# Altium project mat'_v4.PrjPcb (part 1 of 2)
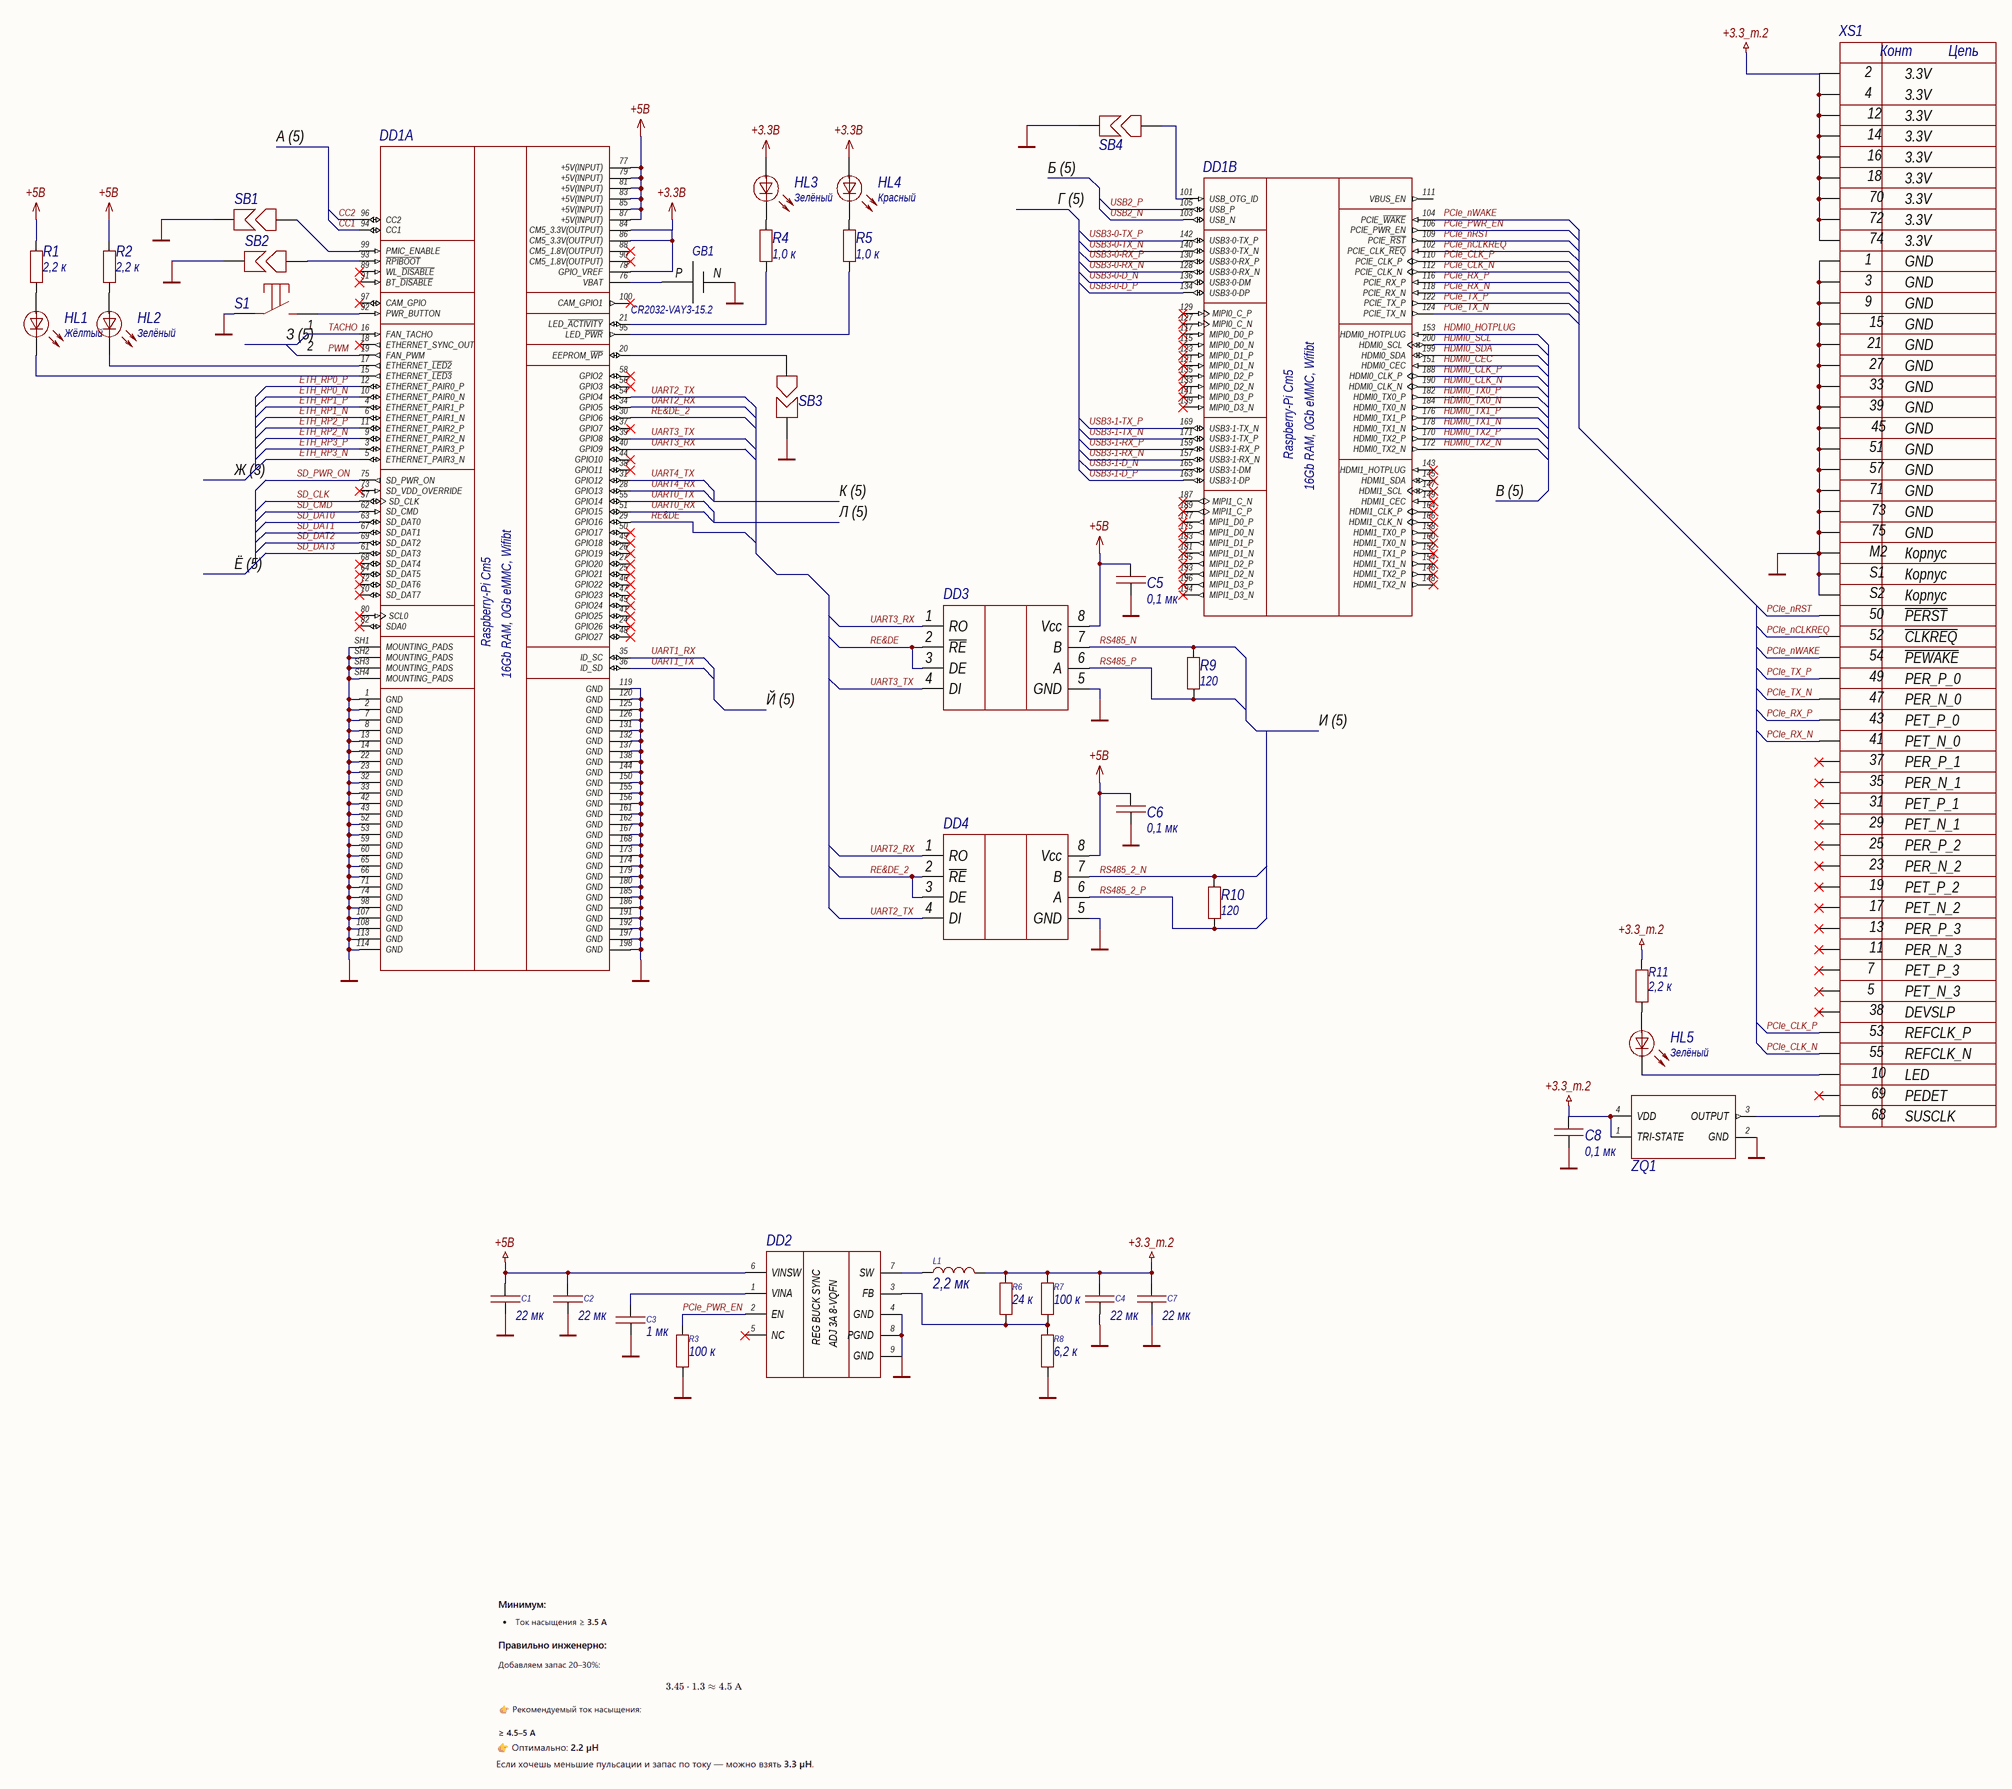
[diagram p0: cm5.SchDoc]
CheckedBy: Захаржевский С.; Decimal_Number_PCB: РТ2.11.03.03.26.08.81.15.002; Decimal_Number_Shematic: РТ2.11.03.03.26.08.81.15.003; DrawnBy: Карманов С.; Release_Date: 16.04.26; Title: Материнская плата аппарата NeoWelt v.2; Title1: Материнская плата; Title2: аппарата NeoWelt v.2; Version: 04
6 sheets, 224 parts. Net scope: global (net labels, ports and power ports of the same name join across sheets).
Board file: motherfucker_pcb.PcbDoc
Sheets:
  cm5.SchDoc
  DCDC_RPI.SchDoc
  1gb_switch.SchDoc
  dc-dc_eth+pump.SchDoc
  connectors.SchDoc
  DCDC_Jetson.SchDoc

## Sheet cm5.SchDoc: Материнская плата аппарата NeoWelt v.2
size 594 x 420 mm; Address1: Address1; Address2: Address2; Address3: Address3; Address4: Address4; DocumentNumber: 1; SheetNumber: 1; SheetTotal: 6; Перв_применение: РТ2.11.03.03.26.08.81.15.003 Э3

### Parts
(Parts that share a designator on the sheet are numbered #1, #2 ... from top to bottom, then left to right.)
C1#1  value 22 мк  [1210C]  (hidden comment: Capacitor)
C2#1  value 22 мк  [1210C]  (hidden comment: Capacitor)
C3#1  value 1 мк  [0603C]  (hidden comment: Capacitor)
C4#1  value 22 мк  [1210C]  (hidden comment: Capacitor)
C5#1  value 0,1 мк  [0603C]  (hidden comment: Capacitor)
C6#1  value 0,1 мк  [0603C]  (hidden comment: Capacitor)
C7#1  value 22 мк  [1210C]  (hidden comment: Capacitor)
C8#1  value 0,1 мк  [0603C]  (hidden comment: Capacitor)
DD1  CM5116000  [CM5116000]  (value not drawn)  (parts A,B of 2)
DD2  ST1S40IPUR  [VFQFPN8-4X4]  (value not drawn)
DD3  MAX485CSA  [SOIC-8]  (value not drawn)
DD4  MAX485CSA  [SOIC-8]  (value not drawn)
GB1  CR2032-VAY3-15.2  [CR2032-VAY3-15.2]
HL1  value Жёлтый  [0603D_yellow]  (hidden comment: LED 0603 YELLOW)
HL2  value Зелёный  [0603D_green]  (hidden comment: LED 0603 GREEN)
HL3  value Зелёный  [0603D_green]  (hidden comment: LED 0603 GREEN)
HL4  value Красный  [0603D_red]  (hidden comment: LED 0603 RED)
HL5  value Зелёный  [0603D_green]  (hidden comment: LED 0603 GREEN)
L1#1  value 2,2 мк  [IHLP-2020]  (hidden comment: IHLP2020BZER2R2M01)
R1  value 2,2 к  [0603R]  (hidden comment: Resistor)
R2#1  value 2,2 к  [0603R]  (hidden comment: Resistor)
R3#1  value 100 к  [0603R]  (hidden comment: Resistor)
R4#1  value 1,0 к  [0603R]  (hidden comment: Resistor)
R5#1  value 1,0 к  [0603R]  (hidden comment: Resistor)
R6#1  value 24 к  [0603R]  (hidden comment: Resistor)
R7#1  value 100 к  [0603R]  (hidden comment: Resistor)
R8#1  value 6,2 к  [0603R]  (hidden comment: Resistor)
R9#1  value 120  [1206R]  (hidden comment: Resistor)
R10#1  value 120  [1206R]  (hidden comment: Resistor)
R11#1  value 2,2 к  [0603R]  (hidden comment: Resistor)
S1  TSS-TD-19XA-XTR  [TSS-TD-19XA-XTR]  (value not drawn)
SB1  SB  [0603SB]  (value not drawn)  (net tie, no BOM)
SB2  SB  [0603SB]  (value not drawn)  (net tie, no BOM)
SB3  SB  [0603SB]  (value not drawn)  (net tie, no BOM)
SB4  SB  [0603SB]  (value not drawn)  (net tie, no BOM)
XS1  123A-30M00  [123A-30M00]  (value not drawn)
ZQ1  ASEK-32.768KHZ-LRT  [XTAL_ASEK-32.768KHZ-LRT]  (value not drawn)

### Nets
+3.3_m.2: C4#1.2 C7#1.2 C8#1.2 L1#1.2 R6#1.2 R7#1.2 R11#1.2 XS1.2(3.3V) XS1.4(3.3V) XS1.12(3.3V) XS1.14(3.3V) XS1.16(3.3V) XS1.18(3.3V) XS1.70(3.3V) XS1.72(3.3V) XS1.74(3.3V) ZQ1.1(TRI-STATE) ZQ1.4(VDD)
+3.3В: DD1.78(GPIO_VREF) DD1.84(CM5_3.3V(OUTPUT)) DD1.86(CM5_3.3V(OUTPUT)) HL3.1 HL4.1
+5В: C1#1.2 C2#1.2 C5#1.2 C6#1.2 DD1.77(+5V(INPUT)) DD1.79(+5V(INPUT)) DD1.81(+5V(INPUT)) DD1.83(+5V(INPUT)) DD1.85(+5V(INPUT)) DD1.87(+5V(INPUT)) DD2.6(VINSW) DD3.8(Vcc) DD4.8(Vcc) R1.2 R2#1.2
GND: C1#1.1 C2#1.1 C3#1.1 C4#1.1 C5#1.1 C6#1.1 C7#1.1 C8#1.1 DD1.1(GND) DD1.2(GND) DD1.7(GND) DD1.8(GND) DD1.13(GND) DD1.14(GND) DD1.22(GND) DD1.23(GND) DD1.32(GND) DD1.33(GND) DD1.42(GND) DD1.43(GND) DD1.52(GND) DD1.53(GND) DD1.59(GND) DD1.60(GND) DD1.65(GND) DD1.66(GND) DD1.71(GND) DD1.74(GND) DD1.98(GND) DD1.107(GND) DD1.108(GND) DD1.113(GND) DD1.114(GND) DD1.119(GND) DD1.120(GND) DD1.125(GND) DD1.126(GND) DD1.131(GND) DD1.132(GND) DD1.137(GND) DD1.138(GND) DD1.144(GND) DD1.150(GND) DD1.155(GND) DD1.156(GND) DD1.161(GND) DD1.162(GND) DD1.167(GND) DD1.168(GND) DD1.173(GND) DD1.174(GND) DD1.179(GND) DD1.180(GND) DD1.185(GND) DD1.186(GND) DD1.191(GND) DD1.192(GND) DD1.197(GND) DD1.198(GND) DD1.SH1(MOUNTING_PADS) DD1.SH2(MOUNTING_PADS) DD1.SH3(MOUNTING_PADS) DD1.SH4(MOUNTING_PADS) DD2.4(GND) DD2.8(PGND) DD2.9(GND) DD3.5(GND) DD4.5(GND) GB1.N R3#1.1 R8#1.1 S1.1 SB1.2 SB2.2 SB3.2 SB4.2 XS1.1(GND) XS1.3(GND) XS1.9(GND) XS1.15(GND) XS1.21(GND) XS1.27(GND) XS1.33(GND) XS1.39(GND) XS1.45(GND) XS1.51(GND) XS1.57(GND) XS1.71(GND) XS1.73(GND) XS1.75(GND) XS1.M2(Корпус) XS1.S1(Корпус) XS1.S2(Корпус) ZQ1.2(GND)
CC1: DD1.94(CC1)
CC2: DD1.96(CC2)
ETH_RP0_N: DD1.10(ETHERNET_PAIR0_N)
ETH_RP0_P: DD1.12(ETHERNET_PAIR0_P)
ETH_RP1_N: DD1.6(ETHERNET_PAIR1_N)
ETH_RP1_P: DD1.4(ETHERNET_PAIR1_P)
ETH_RP2_N: DD1.9(ETHERNET_PAIR2_N)
ETH_RP2_P: DD1.11(ETHERNET_PAIR2_P)
ETH_RP3_N: DD1.5(ETHERNET_PAIR3_N)
ETH_RP3_P: DD1.3(ETHERNET_PAIR3_P)
HDMI0_CEC: DD1.151(HDMI0_CEC)
HDMI0_CLK_N: DD1.190(HDMI0_CLK_N)
HDMI0_CLK_P: DD1.188(HDMI0_CLK_P)
HDMI0_HOTPLUG: DD1.153(HDMI0_HOTPLUG)
HDMI0_SCL: DD1.200(HDMI0_SCL)
HDMI0_SDA: DD1.199(HDMI0_SDA)
HDMI0_TX0_N: DD1.184(HDMI0_TX0_N)
HDMI0_TX0_P: DD1.182(HDMI0_TX0_P)
HDMI0_TX1_N: DD1.178(HDMI0_TX1_N)
HDMI0_TX1_P: DD1.176(HDMI0_TX1_P)
HDMI0_TX2_N: DD1.172(HDMI0_TX2_N)
HDMI0_TX2_P: DD1.170(HDMI0_TX2_P)
PCIe_CLK_N: DD1.112(PCIE_CLK_N) XS1.55(REFCLK_N)
PCIe_CLK_P: DD1.110(PCIE_CLK_P) XS1.53(REFCLK_P)
PCIe_nCLKREQ: DD1.102(PCIE_CLK_~{REQ}) XS1.52(~{CLKREQ})
PCIe_nRST: DD1.109(PCIE_~{RST}) XS1.50(~{PERST})
PCIe_nWAKE: DD1.104(PCIE_~{WAKE}) XS1.54(~{PEWAKE})
PCIe_PWR_EN: DD1.106(PCIE_PWR_EN) DD2.2(EN) R3#1.2
PCIe_RX_N: DD1.118(PCIE_RX_N) XS1.41(PET_N_0)
PCIe_RX_P: DD1.116(PCIE_RX_P) XS1.43(PET_P_0)
PCIe_TX_N: DD1.124(PCIE_TX_N) XS1.47(PER_N_0)
PCIe_TX_P: DD1.122(PCIE_TX_P) XS1.49(PER_P_0)
PWM: DD1.19(FAN_PWM)
RE&DE: DD1.29(GPIO16) DD3.2(~{RE}) DD3.3(DE)
RE&DE_2: DD1.30(GPIO6) DD4.2(~{RE}) DD4.3(DE)
RS485_2_N: DD4.7(B) R10#1.2
RS485_2_P: DD4.6(A) R10#1.1
RS485_N: DD3.7(B) R9#1.2
RS485_P: DD3.6(A) R9#1.1
SD_CLK: DD1.57(SD_CLK)
SD_CMD: DD1.62(SD_CMD)
SD_DAT0: DD1.63(SD_DAT0)
SD_DAT1: DD1.67(SD_DAT1)
SD_DAT2: DD1.69(SD_DAT2)
SD_DAT3: DD1.61(SD_DAT3)
SD_PWR_ON: DD1.75(SD_PWR_ON)
TACHO: DD1.16(FAN_TACHO)
UART0_RX: DD1.51(GPIO15)
UART0_TX: DD1.55(GPIO14)
UART1_RX: DD1.35(ID_SC)
UART1_TX: DD1.36(ID_SD)
UART2_RX: DD1.34(GPIO5) DD4.1(RO)
UART2_TX: DD1.54(GPIO4) DD4.4(DI)
UART3_RX: DD1.40(GPIO9) DD3.1(RO)
UART3_TX: DD1.39(GPIO8) DD3.4(DI)
UART4_RX: DD1.28(GPIO13)
UART4_TX: DD1.31(GPIO12)
USB2_N: DD1.103(USB_N)
USB2_P: DD1.105(USB_P)
USB3-0-D_N: DD1.136(USB3-0-DM)
USB3-0-D_P: DD1.134(USB3-0-DP)
USB3-0-RX_N: DD1.128(USB3-0-RX_N)
USB3-0-RX_P: DD1.130(USB3-0-RX_P)
USB3-0-TX_N: DD1.140(USB3-0-TX_N)
USB3-0-TX_P: DD1.142(USB3-0-TX_P)
USB3-1-D_N: DD1.165(USB3-1-DM)
USB3-1-D_P: DD1.163(USB3-1-DP)
USB3-1-RX_N: DD1.157(USB3-1-RX_N)
USB3-1-RX_P: DD1.159(USB3-1-RX_P)
USB3-1-TX_N: DD1.171(USB3-1-TX_P)
USB3-1-TX_P: DD1.169(USB3-1-TX_N)
NetC3#1_2: C3#1.2 DD2.1(VINA)
NetDD1_15: DD1.15(ETHERNET_~{LED3}) HL1.2
NetDD1_17: DD1.17(ETHERNET_~{LED2}) HL2.2
NetDD1_20: DD1.20(EEPROM_~{WP}) SB3.1
NetDD1_21: DD1.21(LED_~{ACTIVITY}) R4#1.2
NetDD1_76: DD1.76(VBAT) GB1.P
NetDD1_92: DD1.92(PWR_BUTTON) S1.2
NetDD1_93: DD1.93(~{RPIBOOT}) SB2.1
NetDD1_95: DD1.95(LED_~{PWR}) R5#1.2
NetDD1_99: DD1.99(PMIC_ENABLE) SB1.1
NetDD1_101: DD1.101(USB_OTG_ID) SB4.1
NetDD2_3: DD2.3(FB) R6#1.1 R7#1.1 R8#1.2
NetDD2_7: DD2.7(SW) L1#1.1
NetHL1_1: HL1.1 R1.1
NetHL2_1: HL2.1 R2#1.1
NetHL3_2: HL3.2 R4#1.1
NetHL4_2: HL4.2 R5#1.1
NetHL5_1: HL5.1 R11#1.1
NetHL5_2: HL5.2 XS1.10(LED)
NetXS1_68: XS1.68(SUSCLK) ZQ1.3(OUTPUT)

Not connected (* = marked no-connect by the designer): DD1 18(ETHERNET_SYNC_OUT)* 24(GPIO26)* 25(GPIO21)* 26(GPIO19)* 27(GPIO20)* 37(GPIO7)* 38(GPIO11)* 41(GPIO25)* 44(GPIO10)* 45(GPIO24)* 46(GPIO22)* 47(GPIO23)* 48(GPIO27)* 49(GPIO18)* 50(GPIO17)* 56(GPIO3)* 58(GPIO2)* 64(SD_DAT5)* 68(SD_DAT4)* 70(SD_DAT7)* 72(SD_DAT6)* 73(SD_VDD_OVERRIDE)* 80(SCL0)* 82(SDA0)* 88(CM5_1.8V(OUTPUT))* 89(WL_~{DISABLE})* 90(CM5_1.8V(OUTPUT))* 91(BT_~{DISABLE})* 97(CAM_GPIO)* 100(CAM_GPIO1)* 111(VBUS_EN) 115(MIPI0_D0_N)* 117(MIPI0_D0_P)* 121(MIPI0_D1_N)* 123(MIPI0_D1_P)* 127(MIPI0_C_N)* 129(MIPI0_C_P)* 133(MIPI0_D2_N)* 135(MIPI0_D2_P)* 139(MIPI0_D3_N)* 141(MIPI0_D3_P)* 143(HDMI1_HOTPLUG)* 145(HDMI1_SDA)* 146(HDMI1_TX2_P)* 147(HDMI1_SCL)* 148(HDMI1_TX2_N)* 149(HDMI1_CEC)* 152(HDMI1_TX1_P)* 154(HDMI1_TX1_N)* 158(HDMI1_TX0_P)* 160(HDMI1_TX0_N)* 164(HDMI1_CLK_P)* 166(HDMI1_CLK_N)* 175(MIPI1_D0_N)* 177(MIPI1_D0_P)* 181(MIPI1_D1_N)* 183(MIPI1_D1_P)* 187(MIPI1_C_N)* 189(MIPI1_C_P)* 193(MIPI1_D2_N)* 194(MIPI1_D3_N)* 195(MIPI1_D2_P)* 196(MIPI1_D3_P)*; DD2 5(NC)*; XS1 5(PET_N_3)* 7(PET_P_3)* 11(PER_N_3)* 13(PER_P_3)* 17(PET_N_2)* 19(PET_P_2)* 23(PER_N_2)* 25(PER_P_2)* 29(PET_N_1)* 31(PET_P_1)* 35(PER_N_1)* 37(PER_P_1)* 38(DEVSLP)* 69(PEDET)*

### Notes on the sheet
- А (5)
- (near SB4) Б (5)
- Г (5)
- (near S1) З (5)
- (near S1) 1
- (near S1) 2
- Ж (3)
- К (5)
- Л (5)
- В (5)
- Ё (5)
- Й (5)
- И (5)
- Перв. примен.
- Справ. №
- Подп. и дата
- Инв. № дубл.
- Взам. инв. №
- Разраб.
- Изм.
- Лист
- № докум.
- Подп.
- Дата
- Лит.
- Масса
- Масштаб
- Пров.
- Т.контр.
- Схема электрическая принципиальная
- Листов
- Инв. № подл.
- Утв.
- Н.контр.
- Копировал
- Формат А2
- МГТУ им. Н. Э. Баумана
  Кафедра ИУ4
  Группа РТ2-81Б
- (in symbol 123A-30M00) Конт; Цепь
- (in symbol CM5116000, part A) Raspberry-Pi Cm5; 16Gb RAM, 0Gb eMMC, Wifibt
- (in symbol CM5116000, part B) Raspberry-Pi Cm5; 16Gb RAM, 0Gb eMMC, Wifibt
- (in symbol ST1S40IPUR) REG BUCK SYNC; ADJ 3A 8-VQFN

### Library data of the parts
C1#1 C2#1 C4#1 C7#1 = Capacitor_22u_10_25V_X7R_1210C: Конденсатор 1210C ёмкостью 22 мк 10%, 25 В, X7R; Voltage (V): 25; Capacity (nF): 22000; Part Number: Capacitor_22u_10_25V_X7R_1210C; Tolerance: 10%; Dielectric: X7R
C3#1 = Capacitor_1u_10_50V_X7R_0603C: Конденсатор 0603C ёмкостью 1 мк 10%, 50 В, X7R; Voltage (V): 50; Capacity (nF): 1000; Part Number: Capacitor_1u_10_50V_X7R_0603C; Tolerance: 10%; Dielectric: X7R
C5#1 C6#1 C8#1 = Capacitor_0,1u_10_50V_X7R_0603C: Конденсатор 0603C ёмкостью 0,1 мк 10%, 50 В, X7R; Voltage (V): 50; Capacity (nF): 100; Part Number: Capacitor_0,1u_10_50V_X7R_0603C; Tolerance: 10%; Dielectric: X7R
DD1 = CM5116000: Raspberry-Pi Cm5 16Gb RAM, 0Gb eMMC, Wifibt; MF: Raspberry Pi; MP: CM5108064B; Автор: rreali; SnapEDA_Link: https://www.snapeda.com/parts/CM5108064B/Raspberry+Pi/view-part/?ref=snap; Package: None; Value: *; Check_prices: https://www.snapeda.com/parts/CM5108064B/Raspberry+Pi/view-part/?ref=eda; Part Number: CM5116000; Datasheet: https://pip-assets.raspberrypi.com/categories/944-raspberry-pi-compute-module-5/documents/RP-008180-DS-6-cm5-datasheet.pdf?disposition=inline
DD2 = ST1S40IPUR: Преобразователь постоянного тока понижающий синхронный подстраиваемый 3А; MF: STMicroelectronics; Автор: rreali; SnapEDA_Link: https://www.snapeda.com/parts/ST1S40IPUR/STMicroelectronics/view-part/?ref=snap; Package: VDFN-8 STMicroelectronics; Value: *; MP: ST1S40IPUR; Check_prices: https://www.snapeda.com/parts/ST1S40IPUR/STMicroelectronics/view-part/?ref=eda; Part Number: ST1S40IPUR; Datasheet: https://cdn.promelec.ru/upload/datasheet/6/4/CD00284753.pdf
DD3 DD4 = MAX485CSA: RS-485 приёмопередатчик; Part Number: MAX485CSA
GB1 = CR2032-VAY3-15.2: Li, MnO2 батарея типоразмера R20, 3В, 0.22Ач, приваренные выводы, -20...60 °C; Автор: rreali; Part Number: CR2032-VAY3-15.2
HL1 = LED 0603 YELLOW: Светодиод 0603 Жёлтый; Автор: rreali; Part Number: LED 0603 YELLOW
HL2 HL3 HL5 = LED 0603 GREEN: Светодиод 0603 Зелёный; Автор: rreali; Part Number: LED 0603 GREEN
HL4 = LED 0603 RED: Светодиод 0603 Красный; Автор: rreali; Part Number: LED 0603 RED
L1#1 = IHLP2020BZER2R2M01: Катушка индуктивности SMD экранированная 2,2мкГн ±20% 4,2A 50,1мОм 2020 лента на катушке; Inductance (μH): 2,2; Current: 4,5 А; Автор: rreali; Part Number: IHLP2020BZER2R2M01; Datasheet: https://cdn.promelec.ru/upload/datasheet/0/8/ihlp-2020bz-01.pdf
R1 R2#1 R11#1 = Resistor_2.2k_1_0603: Резистор номиналом 2,2 кОм 1%; Power: *; Part Number: Resistor_2.2k_1_0603; Tolerance: 1%
R3#1 R7#1 = Resistor_100k_1_0603: Резистор номиналом 100 кОм 1%; Power: *; Part Number: Resistor_100k_1_0603; Tolerance: 1%
R4#1 R5#1 = Resistor_1.0k_1_0603: Резистор номиналом 1,0 кОм 1%; Power: *; Part Number: Resistor_1.0k_1_0603; Tolerance: 1%
R6#1 = Resistor_24k_1_0603: Резистор номиналом 24 кОм 1%; Power: *; Part Number: Resistor_24k_1_0603; Tolerance: 1%
R8#1 = Resistor_6.2k_1_0603: Резистор номиналом 6,2 кОм 1%; Power: *; Part Number: Resistor_6.2k_1_0603; Tolerance: 1%
R9#1 R10#1 = Resistor_120_1_0603: Резистор номиналом 120 Ом 1%; Power: *; Part Number: Resistor_120_1_0603; Tolerance: 1%
S1 = TSS-TD-19XA-XTR: Тактовая кнопка; Автор: glebmih; Part Number: TSS-TD-19XA-XTR; Datasheet: https://cdn.promelec.ru/upload/items/2023/04/17/TSS-TD-19XA.pdf
SB1-SB4 = SB: Solder bridge, мост припоя, запаиваемая перемычка, net tie, jumper; Автор: rreali; Part Number: SB
XS1 = 123A-30M00: Разъем: M.2 (NGFF); горизонтальный; SMT; gold flash; PIN: 67; 0,5А; System: Connector; Автор: rreali; Part Number: 123A-30M00; Datasheet: https://static.chipdip.ru/lib/882/DOC040882845.pdf
ZQ1 = ASEK-32.768KHZ-LRT: Генератор кварцевый керамика 32.768кГц ±25ppm/°С -40°C....+85В°C SMT; Автор: rreali; Value: 32.768кГц; Availability: Unavailable; Price: None; Package: None; MP: ASEK-32.768KHZ-LRT; Part Number: ASEK-32.768KHZ-LRT

## Sheet DCDC_RPI.SchDoc: Материнская плата аппарата NeoWelt v.2
size 420 x 297 mm; SheetNumber: 4; SheetTotal: 4
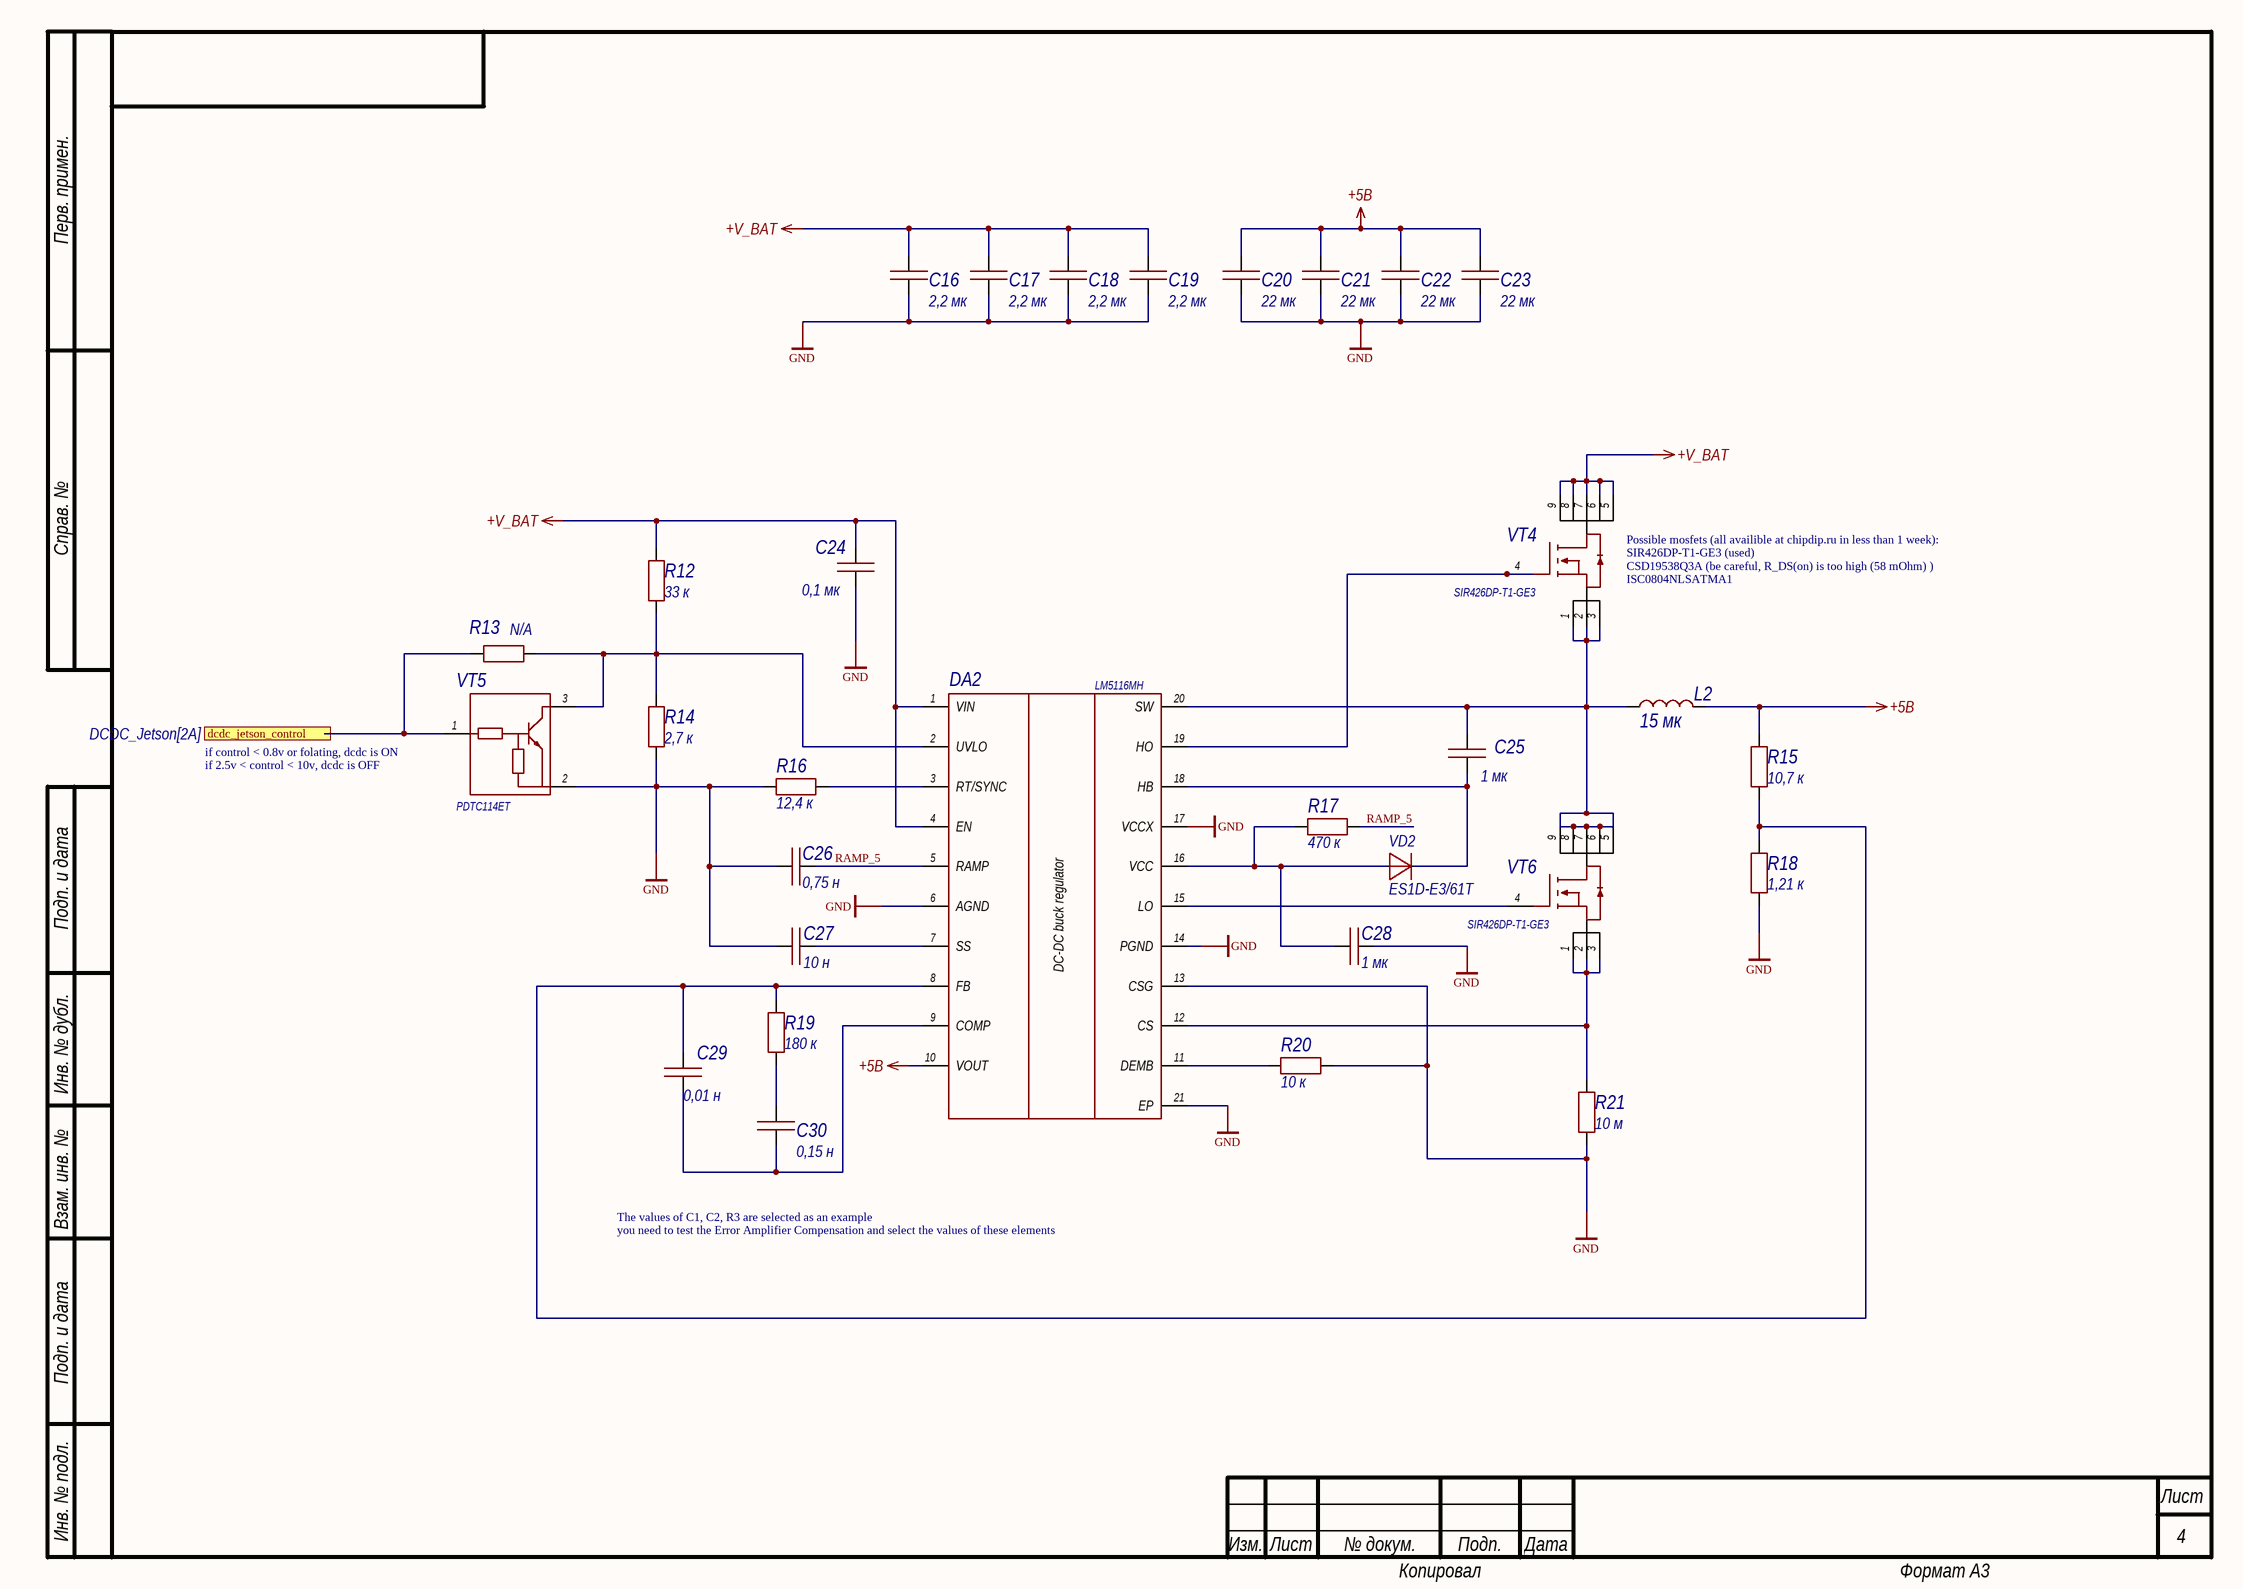
[diagram p1: DCDC_RPI.SchDoc]

### Parts
(Parts that share a designator on the sheet are numbered #1, #2 ... from top to bottom, then left to right.)
C16  value 2,2 мк  [1206C]  (hidden comment: Capacitor)
C17  value 2,2 мк  [1206C]  (hidden comment: Capacitor)
C18  value 2,2 мк  [1206C]  (hidden comment: Capacitor)
C19  value 2,2 мк  [1206C]  (hidden comment: Capacitor)
C20  value 22 мк  [1210C]  (hidden comment: Capacitor)
C21  value 22 мк  [1210C]  (hidden comment: Capacitor)
C22  value 22 мк  [1210C]  (hidden comment: Capacitor)
C23  value 22 мк  [1210C]  (hidden comment: Capacitor)
C24  value 0,1 мк  [0603C]  (hidden comment: Capacitor)
C25#1  value 1 мк  [0603C]  (hidden comment: Capacitor)
C26#1  value 0,75 н  [0603C]  (hidden comment: Capacitor)
C27#1  value 10 н  [0603C]  (hidden comment: Capacitor)
C28#1  value 1 мк  [0603C]  (hidden comment: Capacitor)
C29#1  value 0,01 н  [0603C]  (hidden comment: Capacitor)
C30#1  value 0,15 н  [0603C]  (hidden comment: Capacitor)
DA2#1  LM5116MH  [HTSSOP-20]
L2  value 15 мк  [SPRH127]  (hidden comment: CDSPRH127-150M)
R12  value 33 к  [0603R]  (hidden comment: Resistor)
R13  Resistor  [0603R]  (value not drawn)
R14  value 2,7 к  [0603R]  (hidden comment: Resistor)
R15  value 10,7 к  [0603R]  (hidden comment: Resistor)
R16  value 12,4 к  [0603R]  (hidden comment: Resistor)
R17  value 470 к  [0603R]  (hidden comment: Resistor)
R18  value 1,21 к  [0603R]  (hidden comment: Resistor)
R19  value 180 к  [0603R]  (hidden comment: Resistor)
R20  value 10 к  [0603R]  (hidden comment: Resistor)
R21#1  value 10 м  [1210R]  (hidden comment: Resistor)
VD2  ES1D-E3/61T  [SMA]
VT4#1  SIR426DP-T1-GE3  [PowerPAK_SO-8]
VT5  PDTC114ET  [SOT23-3]
VT6  SIR426DP-T1-GE3  [PowerPAK_SO-8]

### Ports
dcdc_jetson_control (in, see DCDC_Jetson[2A])

### Nets
+5В: C20.2 C21.2 C22.2 C23.2 DA2#1.10(VOUT) L2.2 R15.2
+V_BAT: C16.2 C17.2 C18.2 C19.2 C24.2 DA2#1.1(VIN) DA2#1.4(EN) R12.2 VT4#1.5 VT4#1.6 VT4#1.7 VT4#1.8 VT4#1.9
GND: C16.1 C17.1 C18.1 C19.1 C20.1 C21.1 C22.1 C23.1 C24.1 C26#1.1 C27#1.1 C28#1.2 DA2#1.6(AGND) DA2#1.13(CSG) DA2#1.14(PGND) DA2#1.17(VCCX) DA2#1.21(EP) R14.1 R16.1 R18.1 R20.2 R21#1.1 VT5.2(E)
RAMP_5: C26#1.2 DA2#1.5(RAMP) R17.2
NetC25#1_1: C25#1.1 DA2#1.18(HB) VD2.2
NetC25#1_2: C25#1.2 DA2#1.20(SW) L2.1 VT4#1.1 VT4#1.2 VT4#1.3 VT6.5 VT6.6 VT6.7 VT6.8 VT6.9
NetC27#1_2: C27#1.2 DA2#1.7(SS)
NetC28#1_1: C28#1.1 DA2#1.16(VCC) R17.1 VD2.1
NetC29#1_1: C29#1.1 C30#1.1 DA2#1.9(COMP)
NetC29#1_2: C29#1.2 DA2#1.8(FB) R15.1 R18.2 R19.2
NetC30#1_2: C30#1.2 R19.1
NetDA2#1_2: DA2#1.2(UVLO) R12.1 R13.2 R14.2 VT5.3(C)
NetDA2#1_3: DA2#1.3(RT/SYNC) R16.2
NetDA2#1_11: DA2#1.11(DEMB) R20.1
NetDA2#1_12: DA2#1.12(CS) R21#1.2 VT6.1 VT6.2 VT6.3
NetDA2#1_15: DA2#1.15(LO) VT6.4
NetDA2#1_19: DA2#1.19(HO) VT4#1.4
NetR3#2_1: R13.1 VT5.1(B) ; port dcdc_jetson_control

### Notes on the sheet
- (near VT4#1) Possible mosfets (all availible at chipdip.ru in less than 1 week):
- (near VT4#1) CSD19538Q3A (be careful, R_DS(on) is too high (58 mOhm) )
- (near VT4#1) SIR426DP-T1-GE3 (used)
- (near VT4#1) ISC0804NLSATMA1
- (near VT5) if 2.5v < control < 10v, dcdc is OFF
- (near VT5) if control < 0.8v or folating, dcdc is ON
- The values of C1, C2, R3 are selected as an example
- you need to test the Error Amplifier Compensation and select the values of these elements
- Перв. примен.
- Справ. №
- Подп. и дата
- Инв. № дубл.
- Взам. инв. №
- Инв. № подл.
- Изм.
- Лист
- № докум.
- Подп.
- Дата
- Копировал
- Формат А3
- (in symbol LM5116MH) DC-DC buck regulator

### Library data of the parts
C16-C19 = Capacitor_2,2u_10_50V_X7R_1206C: Конденсатор; Library Path2: Schematic\Capacitor.SchLib; Tolerance: 0,1; Voltage (V): 50; Dielectric: X7R; Capacity (nF): 2200; Part Number: Capacitor_2,2u_10_50V_X7R_1206C
C20-C23 = Capacitor_22u_10_25V_X7R_1210C: Конденсатор; Library Path2: Schematic\Capacitor.SchLib; Tolerance: 0,1; Voltage (V): 25; Dielectric: X7R; Capacity (nF): 22000; Part Number: Capacitor_22u_10_25V_X7R_1210C
C24 = Capacitor_0,1u_10_50V_X7R_0603C: Конденсатор; Library Path2: Schematic\Capacitor.SchLib; Tolerance: 0,1; Voltage (V): 50; Dielectric: X7R; Capacity (nF): 100; Part Number: Capacitor_0,1u_10_50V_X7R_0603C
C25#1 C28#1 = Capacitor_1u_10_50V_X7R_0603C: Конденсатор; Library Path2: Schematic\Capacitor.SchLib; Tolerance: 0,1; Voltage (V): 50; Dielectric: X7R; Capacity (nF): 1000; Part Number: Capacitor_1u_10_50V_X7R_0603C
C26#1 = Capacitor_0,75n_10_50V_X7R_0603C: Конденсатор; Library Path2: Schematic\Capacitor.SchLib; Tolerance: 0,1; Voltage (V): 50; Dielectric: X7R; Capacity (nF): 0,75; Part Number: Capacitor_0,75n_10_50V_X7R_0603C
C27#1 = Capacitor_10n_10_50V_X7R_0603C: Конденсатор; Library Path2: Schematic\Capacitor.SchLib; Tolerance: 0,1; Voltage (V): 50; Dielectric: X7R; Capacity (nF): 10; Part Number: Capacitor_10n_10_50V_X7R_0603C
C29#1 = Capacitor_0,01n_10_50V_X7R_0603C: Конденсатор; Library Path2: Schematic\Capacitor.SchLib; Tolerance: 0,1; Voltage (V): 50; Dielectric: X7R; Capacity (nF): 0,01; Part Number: Capacitor_0,01n_10_50V_X7R_0603C
C30#1 = Capacitor_0,15n_10_50V_X7R_0603C: Конденсатор; Library Path2: Schematic\Capacitor.SchLib; Tolerance: 0,1; Voltage (V): 50; Dielectric: X7R; Capacity (nF): 0,15; Part Number: Capacitor_0,15n_10_50V_X7R_0603C
DA2#1 = LM5116MH: dc-dc понижающий adj 6-100v; Manufacturer_Part_Number: LM5116MH/NOPB; Part Number: LM5116MH
L2 = CDSPRH127-150M: Индуктивность на 15 мкГн, номинальный ток 8,4 А; Inductance (μH): 15; Current (A): 8,4; Part Number: CDSPRH127-150M
R12 = Resistor_33k_1_0603: Резистор номиналом 33 кОм и точностью 1%; Power: *; Part Number: Resistor_33k_1_0603; Tolerance: 1%
R13 = res_0603_N/A: посадочное место 0603 под перемычку; Tolerance: 1%; Power: *; Value: N/A; Part Number: res_0603_N/A
R14 = Resistor_2.7k_1_0603: Резистор номиналом 2,7 кОм и точностью 1%; Power: *; Part Number: Resistor_2.7k_1_0603; Tolerance: 1%
R15 = Resistor_10.7k_1_0603: Резистор номиналом 10,7 кОм и точностью 1%; Power: *; Part Number: Resistor_10.7k_1_0603; Tolerance: 1%
R16 = Resistor_12.4k_1_0603: Резистор номиналом 12,4 кОм и точностью 1%; Power: *; Part Number: Resistor_12.4k_1_0603; Tolerance: 1%
R17 = Resistor_470k_1_0603: Резистор номиналом 470 кОм и точностью 1%; Power: *; Part Number: Resistor_470k_1_0603; Tolerance: 1%
R18 = Resistor_1.21k_1_0603: Резистор номиналом 1,21 кОм и точностью 1%; Power: *; Part Number: Resistor_1.21k_1_0603; Tolerance: 1%
R19 = Resistor_180k_1_0603: Резистор номиналом 180 кОм и точностью 1%; Power: *; Part Number: Resistor_180k_1_0603; Tolerance: 1%
R20 = Resistor_10k_1_0603: Резистор номиналом 10 кОм и точностью 1%; Power: *; Part Number: Resistor_10k_1_0603; Tolerance: 1%
R21#1 = RL1210FR-070R01L: Резистор номиналом 10 мОм, точностью 1%, 0.5Вт; Power: *; Part Number: RL1210FR-070R01L; Tolerance: 1%
VD2 = ES1D-E3/61T: Диод 1A 200V; Repetitive peak reverse voltage (Vrrm): 200; Current (A): 1; Part Number: ES1D-E3/61T
VT4#1 VT6 = SIR426DP-T1-GE3: Транзистор полевой MOSFET N-канальный 40В 41.7Вт; Part Number: SIR426DP-T1-GE3; Напряжение С-И/К-Э: 40 В
VT5 = PDTC114ET: цифровой npn 50в 100мА; Ток макс#: 0, 1 А; Part Number: PDTC114ET; Напряжение С-И/К-Э: 50 В

## Sheet 1gb_switch.SchDoc: Материнская плата аппарата NeoWelt v.2
size 594 x 420 mm; Address1: Address1; Address2: Address2; Address3: Address3; Address4: Address4; DocumentNumber: 3; SheetNumber: 3; SheetTotal: 6; Перв_применение: РТ2.11.03.03.26.08.81.15.003 Э3
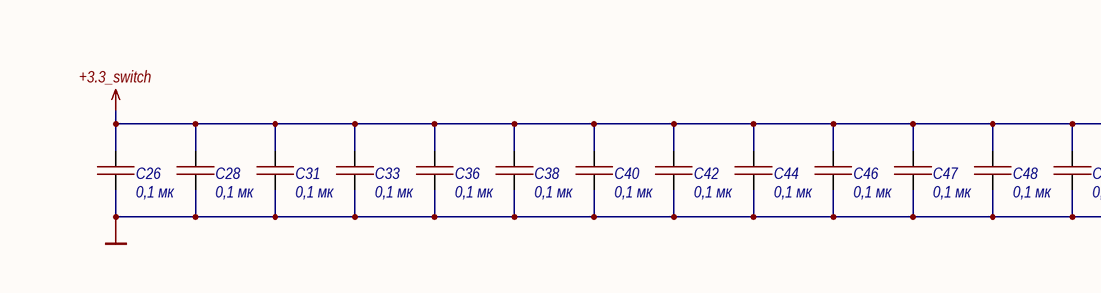
[diagram p2: 1gb_switch.SchDoc, top left]
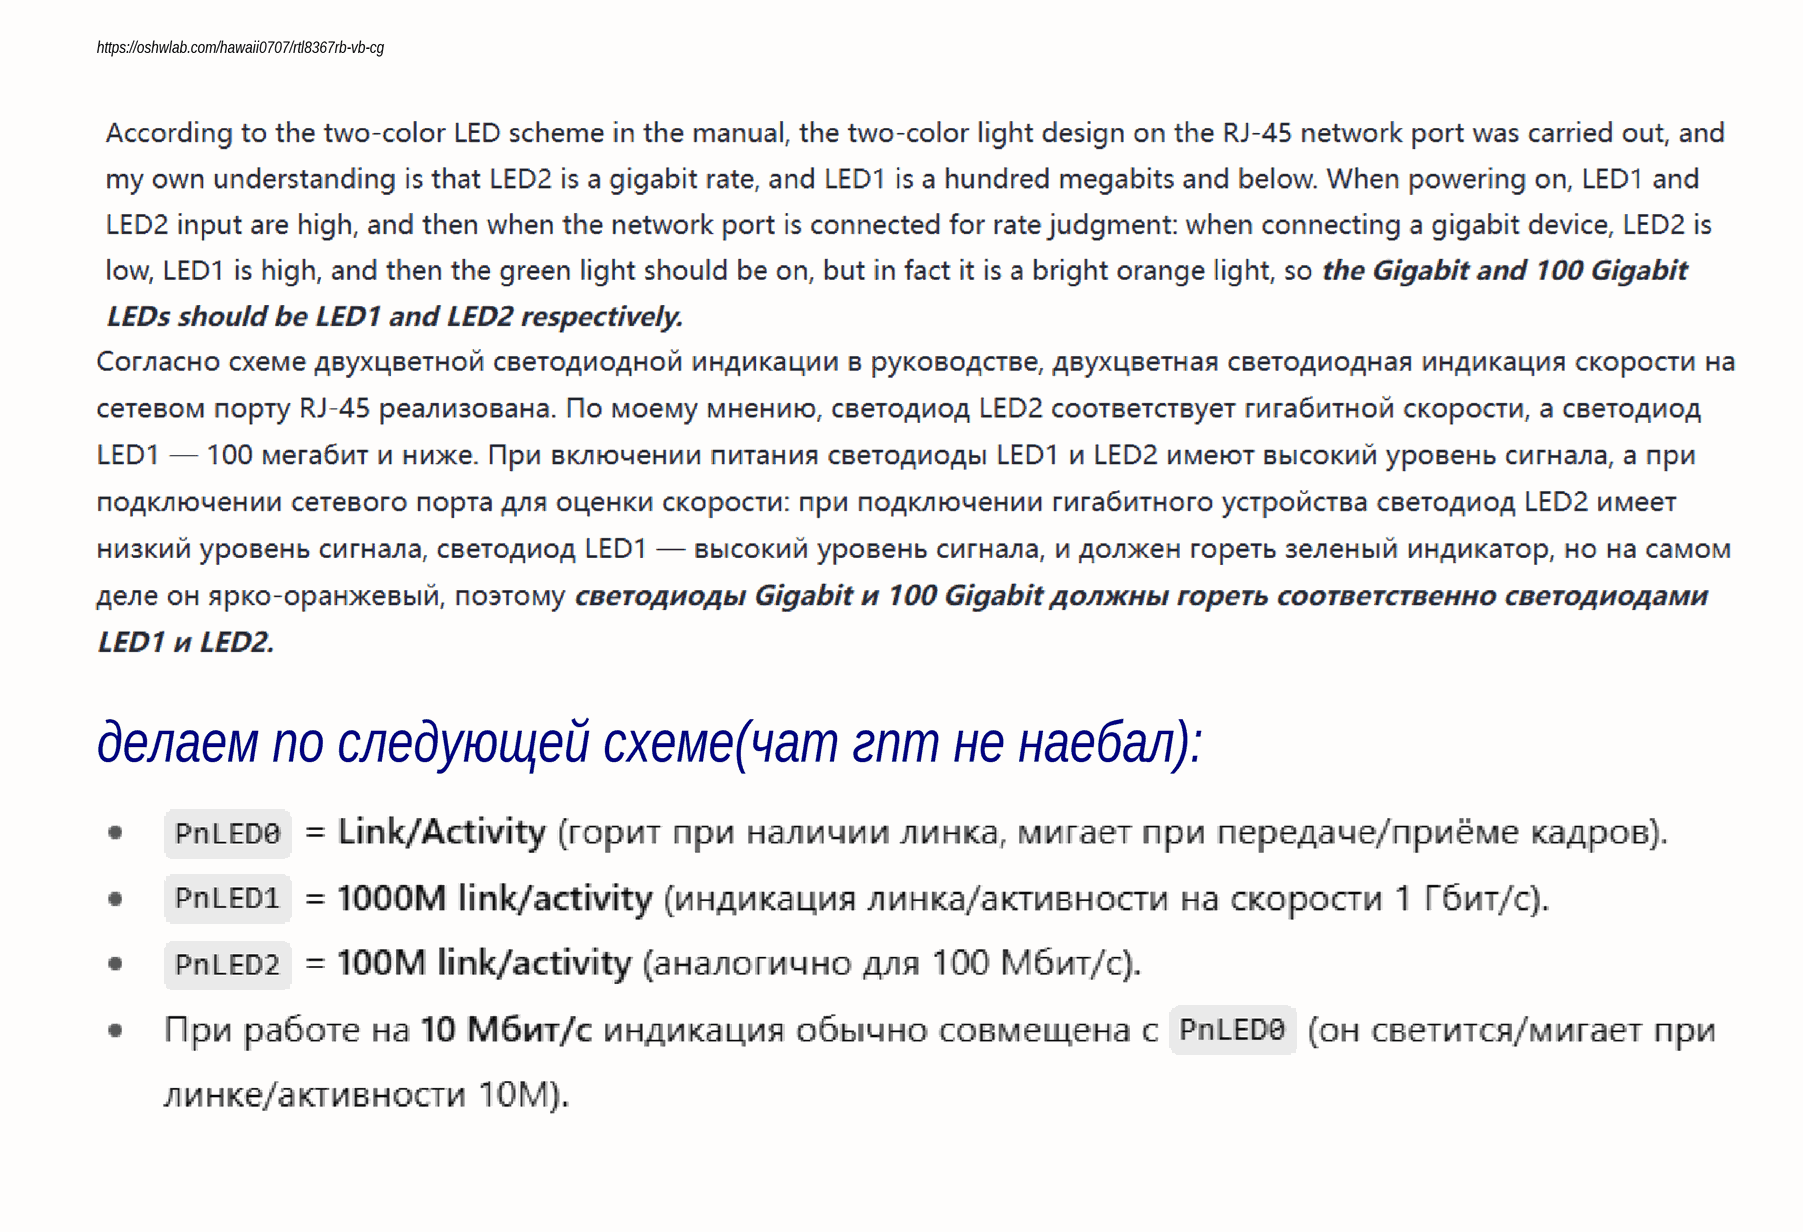
[diagram p3: 1gb_switch.SchDoc, top right]
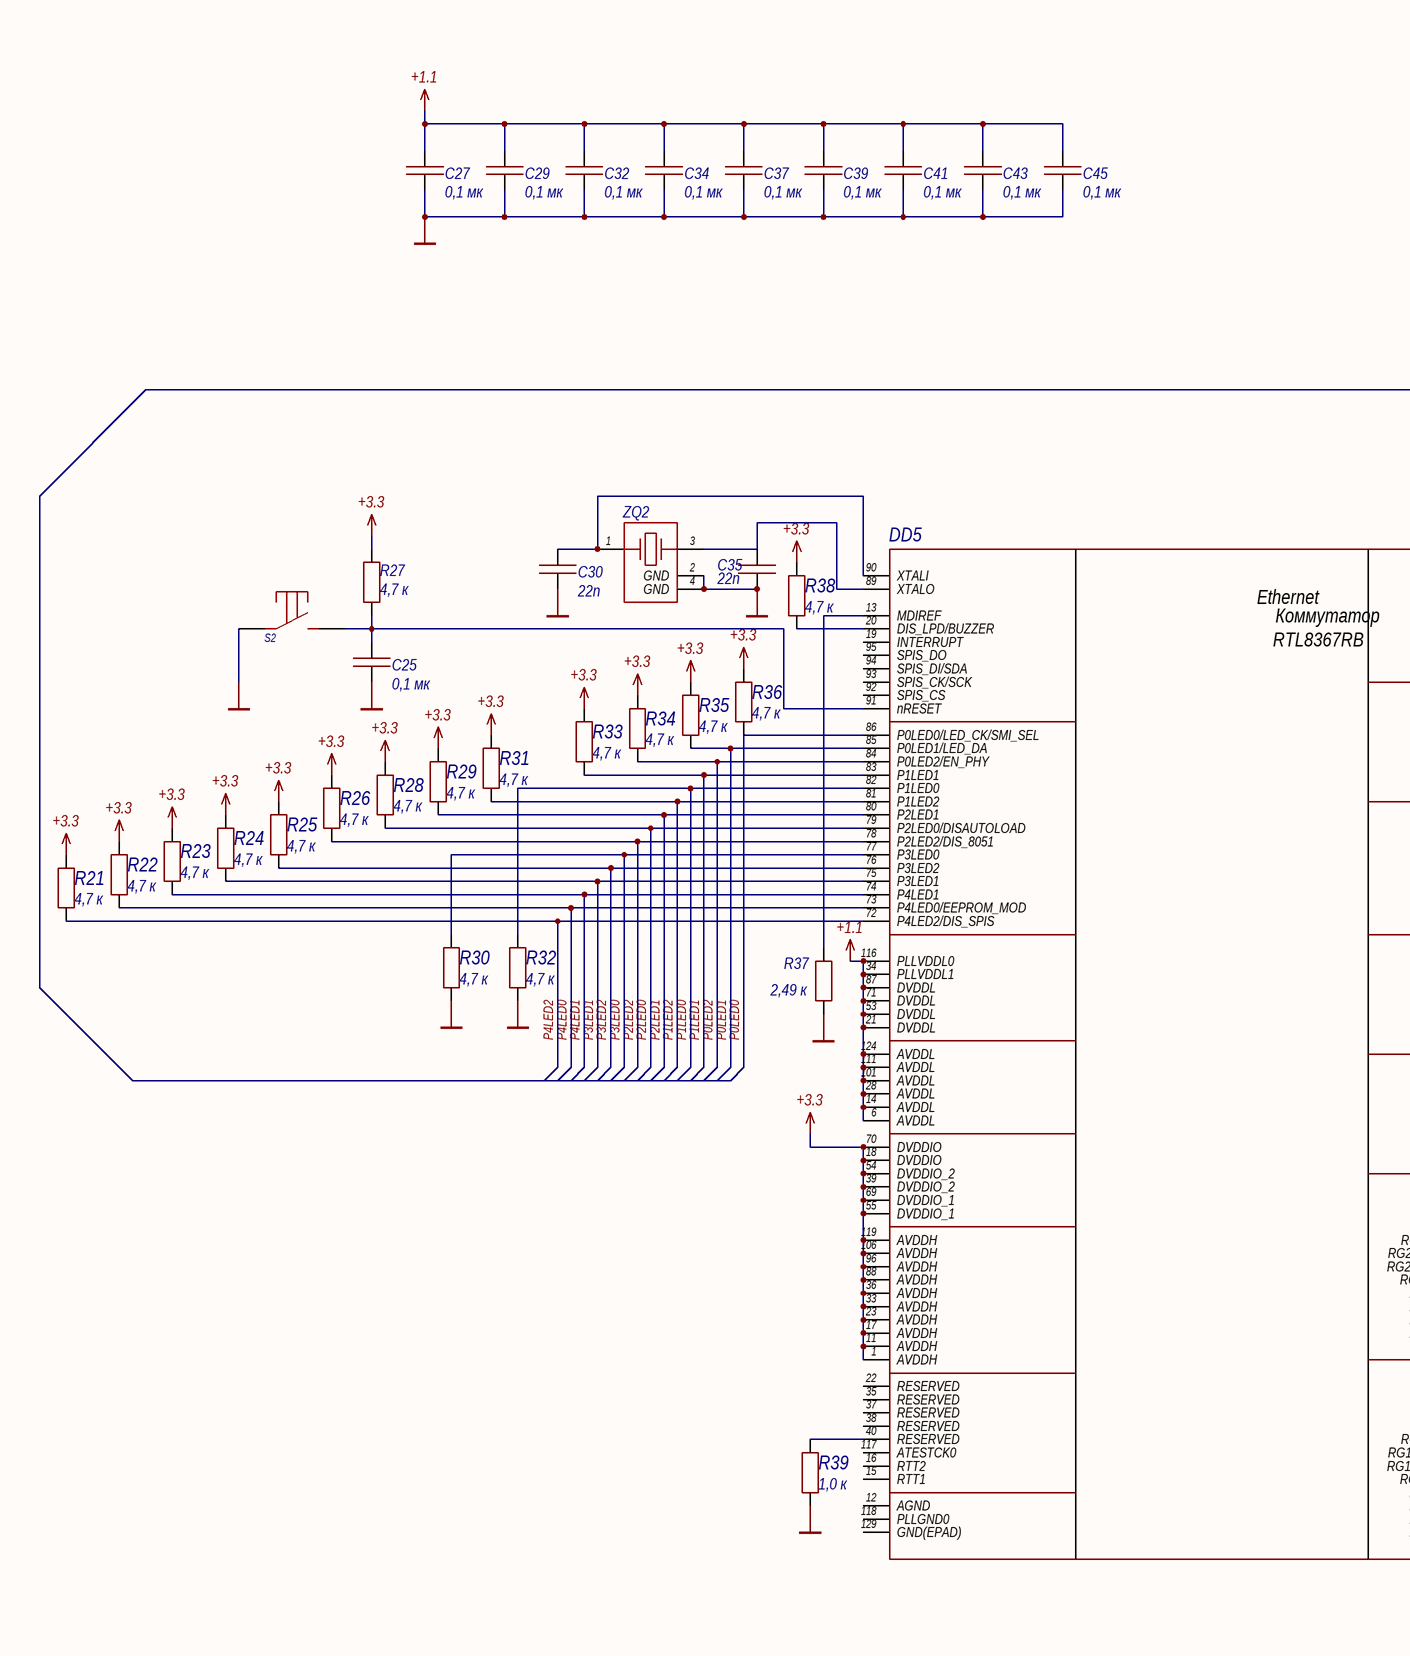
[diagram p4: 1gb_switch.SchDoc, bottom left]
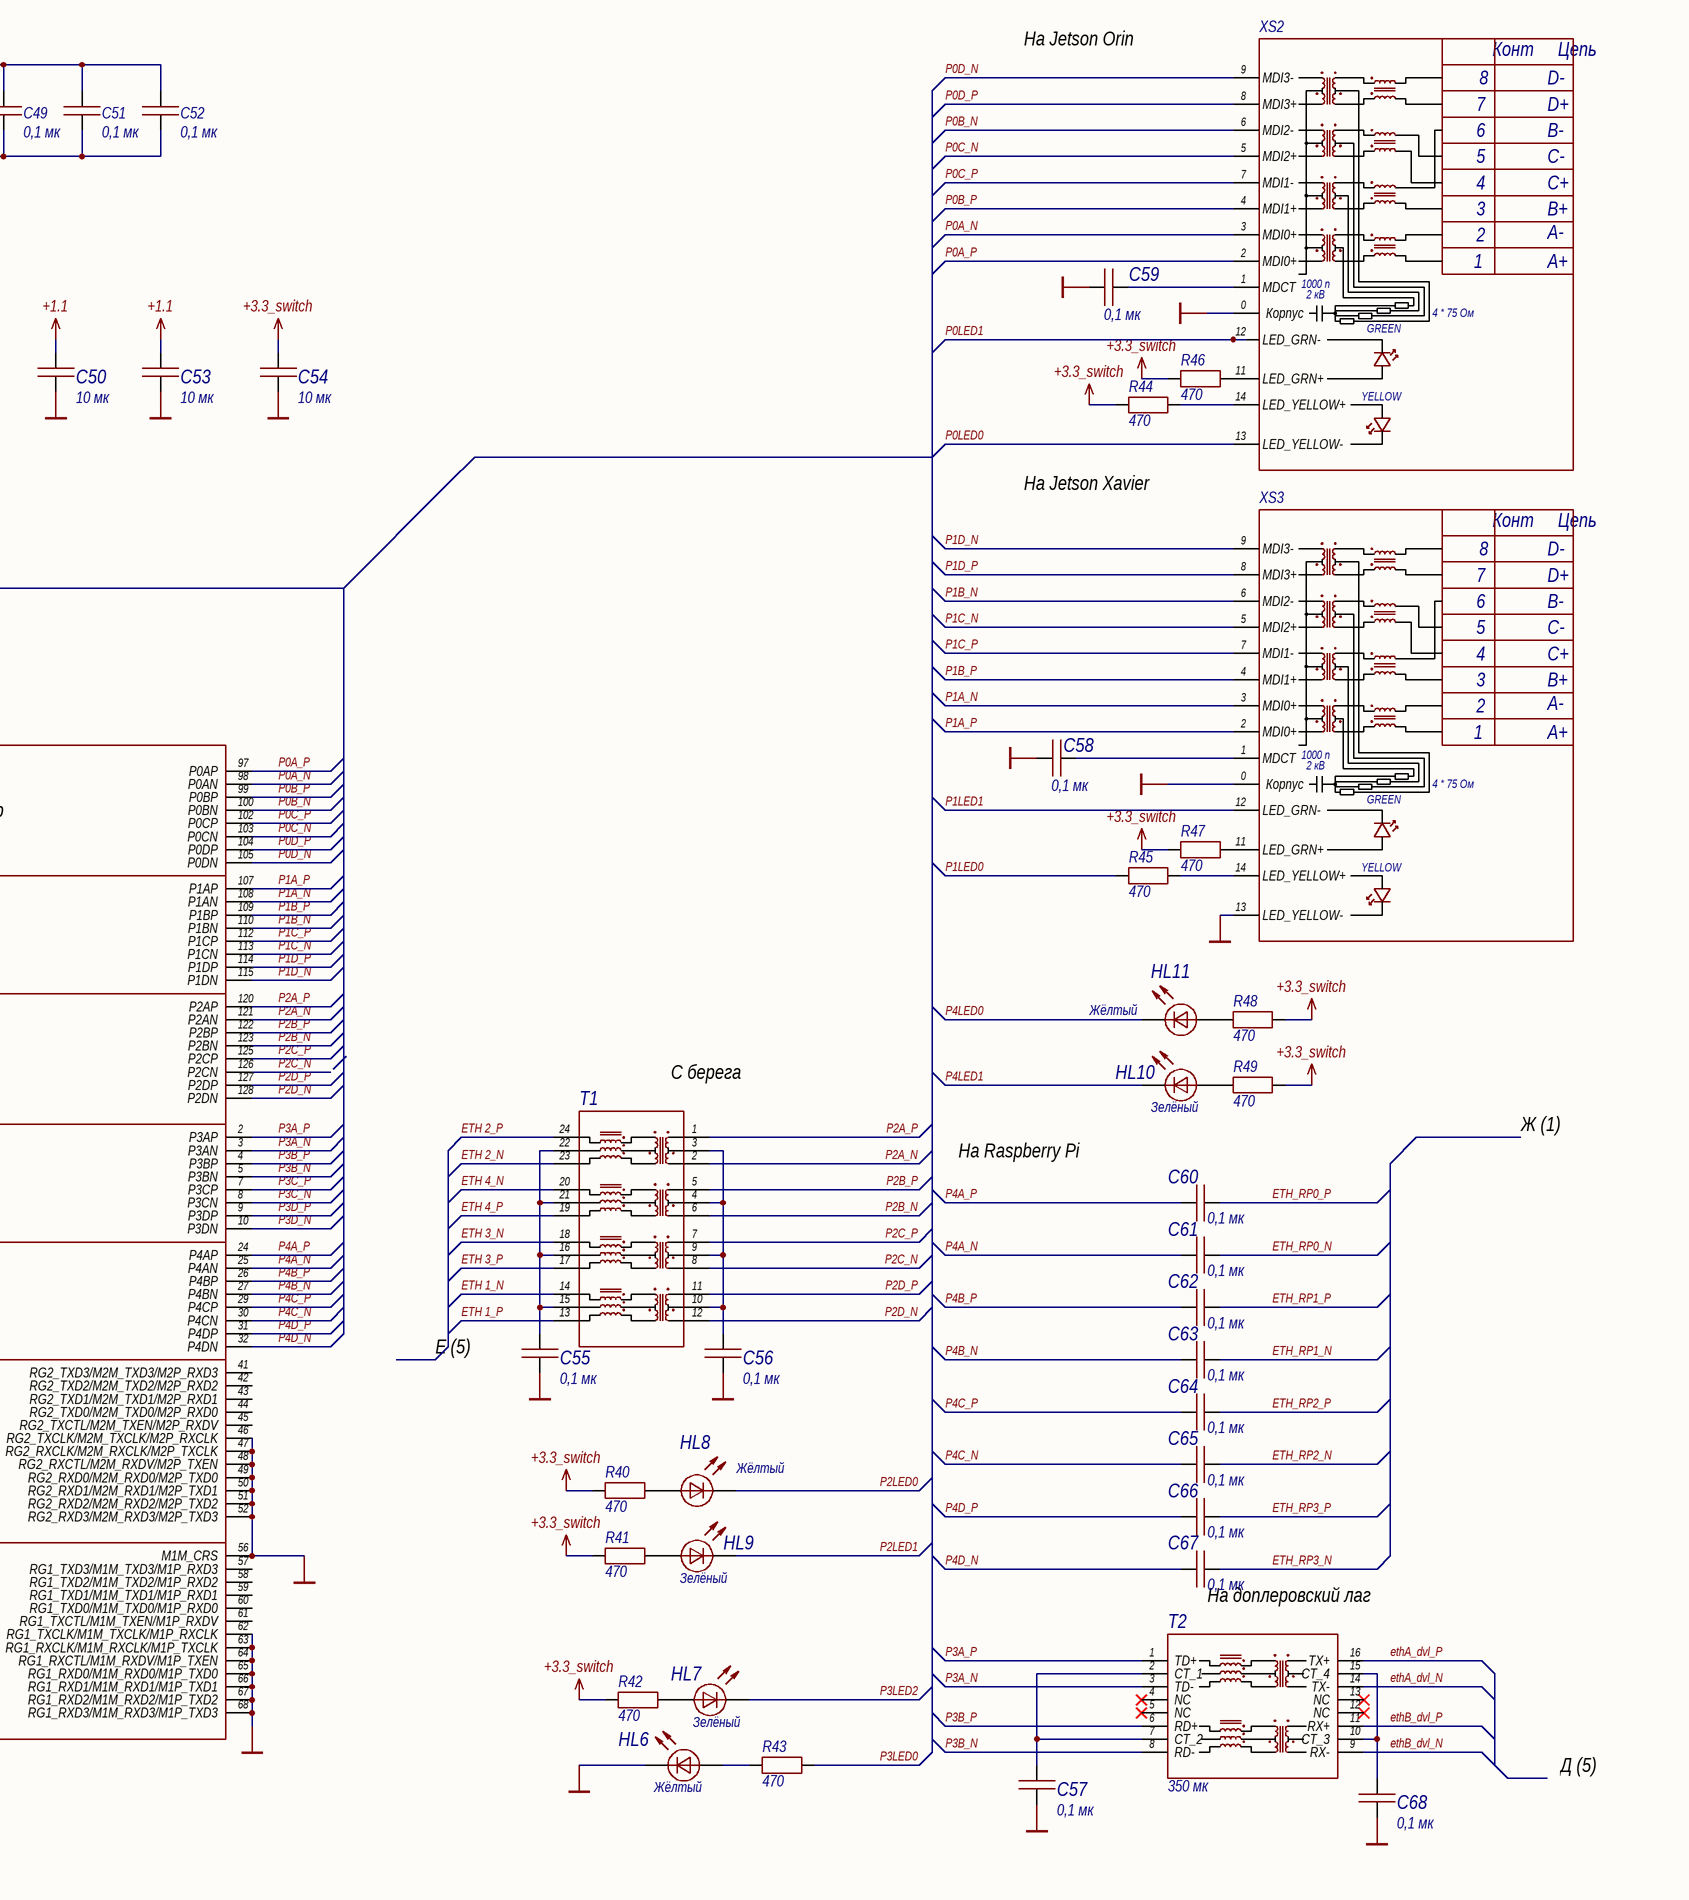
[diagram p5: 1gb_switch.SchDoc, bottom right]

### Parts
(Parts that share a designator on the sheet are numbered #1, #2 ... from top to bottom, then left to right.)
C25#2  value 0,1 мк  [0603C]  (hidden comment: Capacitor)
C26#2  value 0,1 мк  [0402C]  (hidden comment: Capacitor)
C27#2  value 0,1 мк  [0402C]  (hidden comment: Capacitor)
C28#2  value 0,1 мк  [0402C]  (hidden comment: Capacitor)
C29#2  value 0,1 мк  [0402C]  (hidden comment: Capacitor)
C30#2  value 22п  [0603C]  (hidden comment: GRM1885C1H220J)
C31  value 0,1 мк  [0402C]  (hidden comment: Capacitor)
C32  value 0,1 мк  [0402C]  (hidden comment: Capacitor)
C33  value 0,1 мк  [0402C]  (hidden comment: Capacitor)
C34  value 0,1 мк  [0402C]  (hidden comment: Capacitor)
C35  value 22п  [0603C]  (hidden comment: GRM1885C1H220J)
C36  value 0,1 мк  [0402C]  (hidden comment: Capacitor)
C37  value 0,1 мк  [0402C]  (hidden comment: Capacitor)
C38  value 0,1 мк  [0402C]  (hidden comment: Capacitor)
C39  value 0,1 мк  [0402C]  (hidden comment: Capacitor)
C40  value 0,1 мк  [0402C]  (hidden comment: Capacitor)
C41  value 0,1 мк  [0402C]  (hidden comment: Capacitor)
C42  value 0,1 мк  [0402C]  (hidden comment: Capacitor)
C43  value 0,1 мк  [0402C]  (hidden comment: Capacitor)
C44  value 0,1 мк  [0402C]  (hidden comment: Capacitor)
C45  value 0,1 мк  [0402C]  (hidden comment: Capacitor)
C46  value 0,1 мк  [0402C]  (hidden comment: Capacitor)
C47  value 0,1 мк  [0402C]  (hidden comment: Capacitor)
C48  value 0,1 мк  [0402C]  (hidden comment: Capacitor)
C49  value 0,1 мк  [0402C]  (hidden comment: Capacitor)
C50  value 10 мк  [1210C]  (hidden comment: Capacitor)
C51  value 0,1 мк  [0402C]  (hidden comment: Capacitor)
C52  value 0,1 мк  [0402C]  (hidden comment: Capacitor)
C53  value 10 мк  [1210C]  (hidden comment: Capacitor)
C54  value 10 мк  [1210C]  (hidden comment: Capacitor)
C55  value 0,1 мк  [0603C]  (hidden comment: Capacitor)
C56  value 0,1 мк  [0603C]  (hidden comment: Capacitor)
C57  value 0,1 мк  [0603C]  (hidden comment: Capacitor)
C58  value 0,1 мк  [0603C]  (hidden comment: Capacitor)
C59  value 0,1 мк  [0603C]  (hidden comment: Capacitor)
C60  value 0,1 мк  [0402C]  (hidden comment: Capacitor)
C61  value 0,1 мк  [0402C]  (hidden comment: Capacitor)
C62  value 0,1 мк  [0402C]  (hidden comment: Capacitor)
C63  value 0,1 мк  [0402C]  (hidden comment: Capacitor)
C64  value 0,1 мк  [0402C]  (hidden comment: Capacitor)
C65  value 0,1 мк  [0402C]  (hidden comment: Capacitor)
C66  value 0,1 мк  [0402C]  (hidden comment: Capacitor)
C67  value 0,1 мк  [0402C]  (hidden comment: Capacitor)
C68  value 0,1 мк  [0603C]  (hidden comment: Capacitor)
DD5  RTL8367RB-VB  [LQFP128_14x14_exposed_pad]  (value not drawn)
HL6  value Жёлтый  [0603D_yellow]  (hidden comment: LED 0603 YELLOW)
HL7  value Зелёный  [0603D_green]  (hidden comment: LED 0603 GREEN)
HL8  value Жёлтый  [0603D_yellow]  (hidden comment: LED 0603 YELLOW)
HL9  value Зелёный  [0603D_green]  (hidden comment: LED 0603 GREEN)
HL10  value Зелёный  [0603D_green]  (hidden comment: LED 0603 GREEN)
HL11  value Жёлтый  [0603D_yellow]  (hidden comment: LED 0603 YELLOW)
R21#2  value 4,7 к  [0402R]  (hidden comment: Resistor)
R22  value 4,7 к  [0402R]  (hidden comment: Resistor)
R23  value 4,7 к  [0402R]  (hidden comment: Resistor)
R24  value 4,7 к  [0402R]  (hidden comment: Resistor)
R25  value 4,7 к  [0402R]  (hidden comment: Resistor)
R26  value 4,7 к  [0402R]  (hidden comment: Resistor)
R27  value 4,7 к  [0402R]  (hidden comment: Resistor)
R28  value 4,7 к  [0402R]  (hidden comment: Resistor)
R29  value 4,7 к  [0402R]  (hidden comment: Resistor)
R30  value 4,7 к  [0402R]  (hidden comment: Resistor)
R31  value 4,7 к  [0402R]  (hidden comment: Resistor)
R32  value 4,7 к  [0402R]  (hidden comment: Resistor)
R33  value 4,7 к  [0402R]  (hidden comment: Resistor)
R34  value 4,7 к  [0402R]  (hidden comment: Resistor)
R35  value 4,7 к  [0402R]  (hidden comment: Resistor)
R36  value 4,7 к  [0402R]  (hidden comment: Resistor)
R37  value 2,49 к  [0603R]  (hidden comment: RC0603FR-072K49L)
R38  value 4,7 к  [0402R]  (hidden comment: Resistor)
R39  value 1,0 к  [0402R]  (hidden comment: Resistor)
R40  value 470  [0402R]  (hidden comment: Resistor)
R41  value 470  [0402R]  (hidden comment: Resistor)
R42  value 470  [0402R]  (hidden comment: Resistor)
R43  value 470  [0402R]  (hidden comment: Resistor)
R44  value 470  [0402R]  (hidden comment: Resistor)
R45  value 470  [0402R]  (hidden comment: Resistor)
R46  value 470  [0402R]  (hidden comment: Resistor)
R47  value 470  [0402R]  (hidden comment: Resistor)
R48  value 470  [0402R]  (hidden comment: Resistor)
R49  value 470  [0402R]  (hidden comment: Resistor)
S2  TSS-TD-19XA-XTR  [TSS-TD-19XA-XTR]  (value not drawn)
T1  H5120NLT  [H5120NLT]  (value not drawn)
T2  value 350 мк  [B78476A8065A003]  (hidden comment: B78476A8065A003)
XS2  HR911130A  [HR911130A]  (value not drawn)
XS3  HR911130A  [HR911130A]  (value not drawn)
ZQ2  X322525MOB4SI  [X322525MOB4SI]  (value not drawn)

### Nets
+1.1: C27#2.2 C29#2.2 C32.2 C34.2 C37.2 C39.2 C41.2 C43.2 C45.2 C50.2 C53.2 DD5.6(AVDDL) DD5.14(AVDDL) DD5.21(DVDDL) DD5.28(AVDDL) DD5.34(PLLVDDL1) DD5.53(DVDDL) DD5.71(DVDDL) DD5.87(DVDDL) DD5.101(AVDDL) DD5.111(AVDDL) DD5.116(PLLVDDL0) DD5.124(AVDDL)
+3.3: DD5.1(AVDDH) DD5.11(AVDDH) DD5.17(AVDDH) DD5.18(DVDDIO) DD5.23(AVDDH) DD5.33(AVDDH) DD5.36(AVDDH) DD5.39(DVDDIO_2) DD5.54(DVDDIO_2) DD5.55(DVDDIO_1) DD5.69(DVDDIO_1) DD5.70(DVDDIO) DD5.88(AVDDH) DD5.96(AVDDH) DD5.106(AVDDH) DD5.119(AVDDH) R21#2.2 R22.2 R23.2 R24.2 R25.2 R26.2 R27.2 R28.2 R29.2 R31.2 R33.2 R34.2 R35.2 R36.2 R38.2
+3.3_switch: C26#2.2 C28#2.2 C31.2 C33.2 C36.2 C38.2 C40.2 C42.2 C44.2 C46.2 C47.2 C48.2 C49.2 C51.2 C52.2 C54.2 R40.1 R41.1 R42.1 R44.1 R46.1 R47.1 R48.1 R49.1
GND: C25#2.1 C26#2.1 C27#2.1 C28#2.1 C29#2.1 C30#2.1 C31.1 C32.1 C33.1 C34.1 C35.2 C36.1 C37.1 C38.1 C39.1 C40.1 C41.1 C42.1 C43.1 C44.1 C45.1 C46.1 C47.1 C48.1 C49.1 C50.1 C51.1 C52.1 C53.1 C54.1 C55.1 C56.1 C57.1 C58.1 C59.1 C68.1 DD5.46(RG2_TXCLK/M2M_TXCLK/M2P_RXCLK) DD5.47(RG2_RXCLK/M2M_RXCLK/M2P_TXCLK) DD5.48(RG2_RXCTL/M2M_RXDV/M2P_TXEN) DD5.49(RG2_RXD0/M2M_RXD0/M2P_TXD0) DD5.50(RG2_RXD1/M2M_RXD1/M2P_TXD1) DD5.51(RG2_RXD2/M2M_RXD2/M2P_TXD2) DD5.52(RG2_RXD3/M2M_RXD3/M2P_TXD3) DD5.56(M1M_CRS) DD5.62(RG1_TXCLK/M1M_TXCLK/M1P_RXCLK) DD5.63(RG1_RXCLK/M1M_RXCLK/M1P_TXCLK) DD5.64(RG1_RXCTL/M1M_RXDV/M1P_TXEN) DD5.65(RG1_RXD0/M1M_RXD0/M1P_TXD0) DD5.66(RG1_RXD1/M1M_RXD1/M1P_TXD1) DD5.67(RG1_RXD2/M1M_RXD2/M1P_TXD2) DD5.68(RG1_RXD3/M1M_RXD3/M1P_TXD3) HL6.2 R30.1 R32.1 R37.1 R39.1 S2.1 XS2.0(Корпус) XS3.0(Корпус) XS3.13(LED_YELLOW-) ZQ2.2(GND) ZQ2.4(GND)
ETH 1_N: T1.14
ETH 1_P: T1.13
ETH 2_N: T1.23
ETH 2_P: T1.24
ETH 3_N: T1.18
ETH 3_P: T1.17
ETH 4_N: T1.20
ETH 4_P: T1.19
ETH_RP0_N: C61.2
ETH_RP0_P: C60.2
ETH_RP1_N: C63.2
ETH_RP1_P: C62.2
ETH_RP2_N: C65.2
ETH_RP2_P: C64.2
ETH_RP3_N: C67.2
ETH_RP3_P: C66.2
ethA_dvl_N: T2.14(TX-)
ethA_dvl_P: T2.16(TX+)
ethB_dvl_N: T2.9(RX-)
ethB_dvl_P: T2.11(RX+)
P0A_N: DD5.98(P0AN) XS2.3(MDI0+)
P0A_P: DD5.97(P0AP) XS2.2(MDI0+)
P0B_N: DD5.100(P0BN) XS2.6(MDI2-)
P0B_P: DD5.99(P0BP) XS2.4(MDI1+)
P0C_N: DD5.103(P0CN) XS2.5(MDI2+)
P0C_P: DD5.102(P0CP) XS2.7(MDI1-)
P0D_N: DD5.105(P0DN) XS2.9(MDI3-)
P0D_P: DD5.104(P0DP) XS2.8(MDI3+)
P0LED0: DD5.86(P0LED0/LED_CK/SMI_SEL) R36.1 XS2.13(LED_YELLOW-)
P0LED1: DD5.85(P0LED1/LED_DA) R35.1 XS2.12(LED_GRN-)
P0LED2: DD5.84(P0LED2/EN_PHY) R34.1
P1A_N: DD5.108(P1AN) XS3.3(MDI0+)
P1A_P: DD5.107(P1AP) XS3.2(MDI0+)
P1B_N: DD5.110(P1BN) XS3.6(MDI2-)
P1B_P: DD5.109(P1BP) XS3.4(MDI1+)
P1C_N: DD5.113(P1CN) XS3.5(MDI2+)
P1C_P: DD5.112(P1CP) XS3.7(MDI1-)
P1D_N: DD5.115(P1DN) XS3.9(MDI3-)
P1D_P: DD5.114(P1DP) XS3.8(MDI3+)
P1LED0: DD5.82(P1LED0) R32.2 R45.1
P1LED1: DD5.83(P1LED1) R33.1 XS3.12(LED_GRN-)
P1LED2: DD5.81(P1LED2) R31.1
P2A_N: DD5.121(P2AN) T1.2
P2A_P: DD5.120(P2AP) T1.1
P2B_N: DD5.123(P2BN) T1.6
P2B_P: DD5.122(P2BP) T1.5
P2C_N: DD5.126(P2CN) T1.8
P2C_P: DD5.125(P2CP) T1.7
P2D_N: DD5.128(P2DN) T1.12
P2D_P: DD5.127(P2DP) T1.11
P2LED0: DD5.79(P2LED0/DISAUTOLOAD) HL8.2 R28.1
P2LED1: DD5.80(P2LED1) HL9.2 R29.1
P2LED2: DD5.78(P2LED2/DIS_8051) R26.1
P3A_N: DD5.3(P3AN) T2.3(TD-)
P3A_P: DD5.2(P3AP) T2.1(TD+)
P3B_N: DD5.5(P3BN) T2.8(RD-)
P3B_P: DD5.4(P3BP) T2.6(RD+)
P3C_N: DD5.8(P3CN)
P3C_P: DD5.7(P3CP)
P3D_N: DD5.10(P3DN)
P3D_P: DD5.9(P3DP)
P3LED0: DD5.77(P3LED0) R30.2 R43.1
P3LED1: DD5.75(P3LED1) R24.1
P3LED2: DD5.76(P3LED2) HL7.2 R25.1
P4A_N: C61.1 DD5.25(P4AN)
P4A_P: C60.1 DD5.24(P4AP)
P4B_N: C63.1 DD5.27(P4BN)
P4B_P: C62.1 DD5.26(P4BP)
P4C_N: C65.1 DD5.30(P4CN)
P4C_P: C64.1 DD5.29(P4CP)
P4D_N: C67.1 DD5.32(P4DN)
P4D_P: C66.1 DD5.31(P4DP)
P4LED0: DD5.73(P4LED0/EEPROM_MOD) HL11.2 R22.1
P4LED1: DD5.74(P4LED1) HL10.2 R23.1
P4LED2: DD5.72(P4LED2/DIS_SPIS) R21#2.1
NetC25#2_2: C25#2.2 DD5.91(nRESET) R27.1 S2.2
NetC30#2_2: C30#2.2 DD5.90(XTALI) ZQ2.1
NetC35_1: C35.1 DD5.89(XTALO) ZQ2.3
NetC55_2: C55.2 T1.15 T1.16 T1.21 T1.22
NetC56_2: C56.2 T1.3 T1.4 T1.9 T1.10
NetC57_2: C57.2 T2.2(CT_1) T2.7(CT_2)
NetC58_2: C58.2 XS3.1(MDCT)
NetC59_2: C59.2 XS2.1(MDCT)
NetC68_2: C68.2 T2.10(CT_3) T2.15(CT_4)
NetDD5_13: DD5.13(MDIREF) R37.2
NetDD5_20: DD5.20(DIS_LPD/BUZZER) R38.1
NetDD5_40: DD5.40(RESERVED) R39.2
NetHL6_1: HL6.1 R43.2
NetHL7_1: HL7.1 R42.2
NetHL8_1: HL8.1 R40.2
NetHL9_1: HL9.1 R41.2
NetHL10_1: HL10.1 R49.2
NetHL11_1: HL11.1 R48.2
NetR44_2: R44.2 XS2.14(LED_YELLOW+)
NetR45_2: R45.2 XS3.14(LED_YELLOW+)
NetR46_2: R46.2 XS2.11(LED_GRN+)
NetR47_2: R47.2 XS3.11(LED_GRN+)

Not connected (* = marked no-connect by the designer): DD5 12(AGND) 15(RTT1) 16(RTT2) 19(INTERRUPT) 22(RESERVED) 35(RESERVED) 37(RESERVED) 38(RESERVED) 41(RG2_TXD3/M2M_TXD3/M2P_RXD3) 42(RG2_TXD2/M2M_TXD2/M2P_RXD2) 43(RG2_TXD1/M2M_TXD1/M2P_RXD1) 44(RG2_TXD0/M2M_TXD0/M2P_RXD0) 45(RG2_TXCTL/M2M_TXEN/M2P_RXDV) 57(RG1_TXD3/M1M_TXD3/M1P_RXD3) 58(RG1_TXD2/M1M_TXD2/M1P_RXD2) 59(RG1_TXD1/M1M_TXD1/M1P_RXD1) 60(RG1_TXD0/M1M_TXD0/M1P_RXD0) 61(RG1_TXCTL/M1M_TXEN/M1P_RXDV) 92(SPIS_CS) 93(SPIS_CK/SCK) 94(SPIS_DI/SDA) 95(SPIS_DO) 117(ATESTCK0) 118(PLLGND0) 129(GND(EPAD)); T2 4(NC)* 5(NC)* 12(NC)* 13(NC)*

### Notes on the sheet
- https://oshwlab.com/hawaii0707/rtl8367rb-vb-cg
- делаем по следующей схеме(чат гпт не наебал):
- На Jetson Orin
- На Jetson Xavier
- (near T1) С берега
- На Raspberry Pi
- Ж (1)
- Е (5)
- (near C67) На доплеровский лаг
- Д (5)
- Перв. примен.
- Справ. №
- Подп. и дата
- Инв. № дубл.
- Взам. инв. №
- Инв. № подл.
- Изм.
- Лист
- № докум.
- Подп.
- Дата
- Копировал
- Формат А2
- (in symbol HR911130A) Конт; Цепь; D-; D+; B-; C-; C+; B+; A-; A+; 1000 п; 2 кВ; 4 * 75 Ом; GREEN; YELLOW
- (in symbol RTL8367RB-VB) Ethernet; Коммутатор; RTL8367RB

### Library data of the parts
C25#2 C55-C59 C68 = Capacitor_0,1u_10_50V_X7R_0603C: as C5#1 on sheet cm5; Part Number: Capacitor_0,1u_10_50V_X7R_0603C; Tolerance: 10%; Dielectric: X7R
C26#2 C27#2 C28#2 C29#2 C31-C34 C36-C49 C51 C52 C60-C67 = Capacitor_0,1u_10_16V_X7R_0603C: Конденсатор 0402C ёмкостью 0,1 мк 10%, 16 В, X7R; Voltage (V): 16; Capacity (nF): 100; Автор: rreali; Part Number: Capacitor_0,1u_10_16V_X7R_0603C; Tolerance: 10%; Dielectric: X7R
C30#2 C35 = GRM1885C1H220J: Конденсатор 0603C ёмкостью 22п 5%, 50 В, NP0; Voltage (V): 50; Capacity (nF): 0,022; Автор: rreali; Datasheet: https://cdn.promelec.ru/upload/items/2020/02/18/MURATA_MLCC_catalog_C02E_short_.pdf; Part Number: GRM1885C1H220J; Tolerance: 5%; Dielectric: NP0
C50 C53 C54 = Capacitor_10u_10_35V_X7R_1210C: Конденсатор 1210C ёмкостью 10 мк 10%, 35 В, X7R; Voltage (V): 35; Capacity (nF): 10000; Part Number: Capacitor_10u_10_35V_X7R_1210C; Tolerance: 10%; Dielectric: X7R
DD5 = RTL8367RB-VB: Управляемый коммутатор второго уровня на 5+2 порта 10/100/1000M; Автор: rreali; Part Number: RTL8367RB-VB; Datasheet: https://static.chipdip.ru/lib/518/DOC041518607.pdf
HL6 HL8 HL11 = LED 0603 YELLOW: Светодиод 0603 Жёлтый; Автор: rreali; Part Number: LED 0603 YELLOW
HL7 HL9 HL10 = LED 0603 GREEN: Светодиод 0603 Зелёный; Автор: rreali; Part Number: LED 0603 GREEN
R21#2 R22-R36 R38 = Resistor_4.7k_1_0402: Резистор номиналом 4,7 кОм 1%; Автор: rreali; Power: *; Part Number: Resistor_4.7k_1_0402; Tolerance: 1%
R37 = RC0603FR-072K49L: 0.1Вт 0603 2.49 кОм, 1%, Чип резистор; Автор: rreali; Power: *; Part Number: RC0603FR-072K49L; Tolerance: 1%
R39 = Resistor_1.0k_1_0402: Резистор номиналом 1,0 кОм 1%; Автор: rreali; Power: *; Part Number: Resistor_1.0k_1_0402; Tolerance: 1%
R40-R49 = Resistor_470_1_0402: Резистор номиналом 470 Ом 1%; Автор: rreali; Power: *; Part Number: Resistor_470_1_0402; Tolerance: 1%
S2 = TSS-TD-19XA-XTR: Тактовая кнопка; Автор: glebmih; Part Number: TSS-TD-19XA-XTR; Datasheet: https://cdn.promelec.ru/upload/items/2023/04/17/TSS-TD-19XA.pdf
T1 = H5120NLT: Телекоммуникационный трансформатор 10/100/1000 Base-T, 1CT:1CT, изоляция 1500В; Value: 350 мк; Inductance (μH): 0; Current: 0,0 А; Автор: rreali; Part Number: H5120NLT; Datasheet: cdn.promelec.ru/upload/items/2024/01/29/H5120NL_.pdf
T2 = B78476A8065A003: Телекоммуникационный трансформатор, 10/100Base-T 1CT:1CT, 16 выводов, 12.7x6.9x5.6mm; Manufacturer_Name: TDK; Geometry.Height: 5.85mm; Inductance (μH): 0; Current: 0,0 А; Автор: rreali; Manufacturer_Part_Number: B78476A8065A003; Mouser Part Number: 871-B78476A8065A3; Mouser Price/Stock: https://www.mouser.co.uk/ProductDetail/EPCOS-TDK/B78476A8065A003?qs=Uha62PnlbFBmivqA6S0Irg%3D%3D; Arrow Part Number: B78476A8065A003; Arrow Price/Stock: https://www.arrow.com/en/products/b78476a8065a003/epcos-tdk; Datasheet Link: https://product.tdk.com/system/files/dam/doc/product/transformer/transformer/lan/data_sheet/30/ds/lan_mod/b78476a8065a003.pdf; Part Number: B78476A8065A003; Datasheet: https://cdn.promelec.ru/upload/datasheet/8/0/B78476A8065A003.pdf
XS2 XS3 = HR911130A: Однопортовый магнитный разъем RJ45 100/1000Base-T со встроенным трансформатором и светодиодами; System: Connector; Автор: rreali; Part Number: HR911130A; Datasheet: https://cdn.promelec.ru/upload/items/2023/08/23/HR911130A_.pdf
ZQ2 = X322525MOB4SI: Кварцевый резонатор SMD 25 МГц ±10ppm SMD-3225_4P; Value: 25 МГц; Автор: rreali; Part Number: X322525MOB4SI; Datasheet: https://datasheet.lcsc.com/lcsc/Yangxing-Tech-X322525MOB4SI_C9006.pdf

## Sheet dc-dc_eth+pump.SchDoc: Материнская плата аппарата NeoWelt v.2
size 420 x 297 mm; Address1: Address1; Address2: Address2; Address3: Address3; Address4: Address4; DocumentNumber: 4; SheetNumber: 4; SheetTotal: 6; Перв_применение: РТ2.11.03.03.26.08.81.15.003 Э3
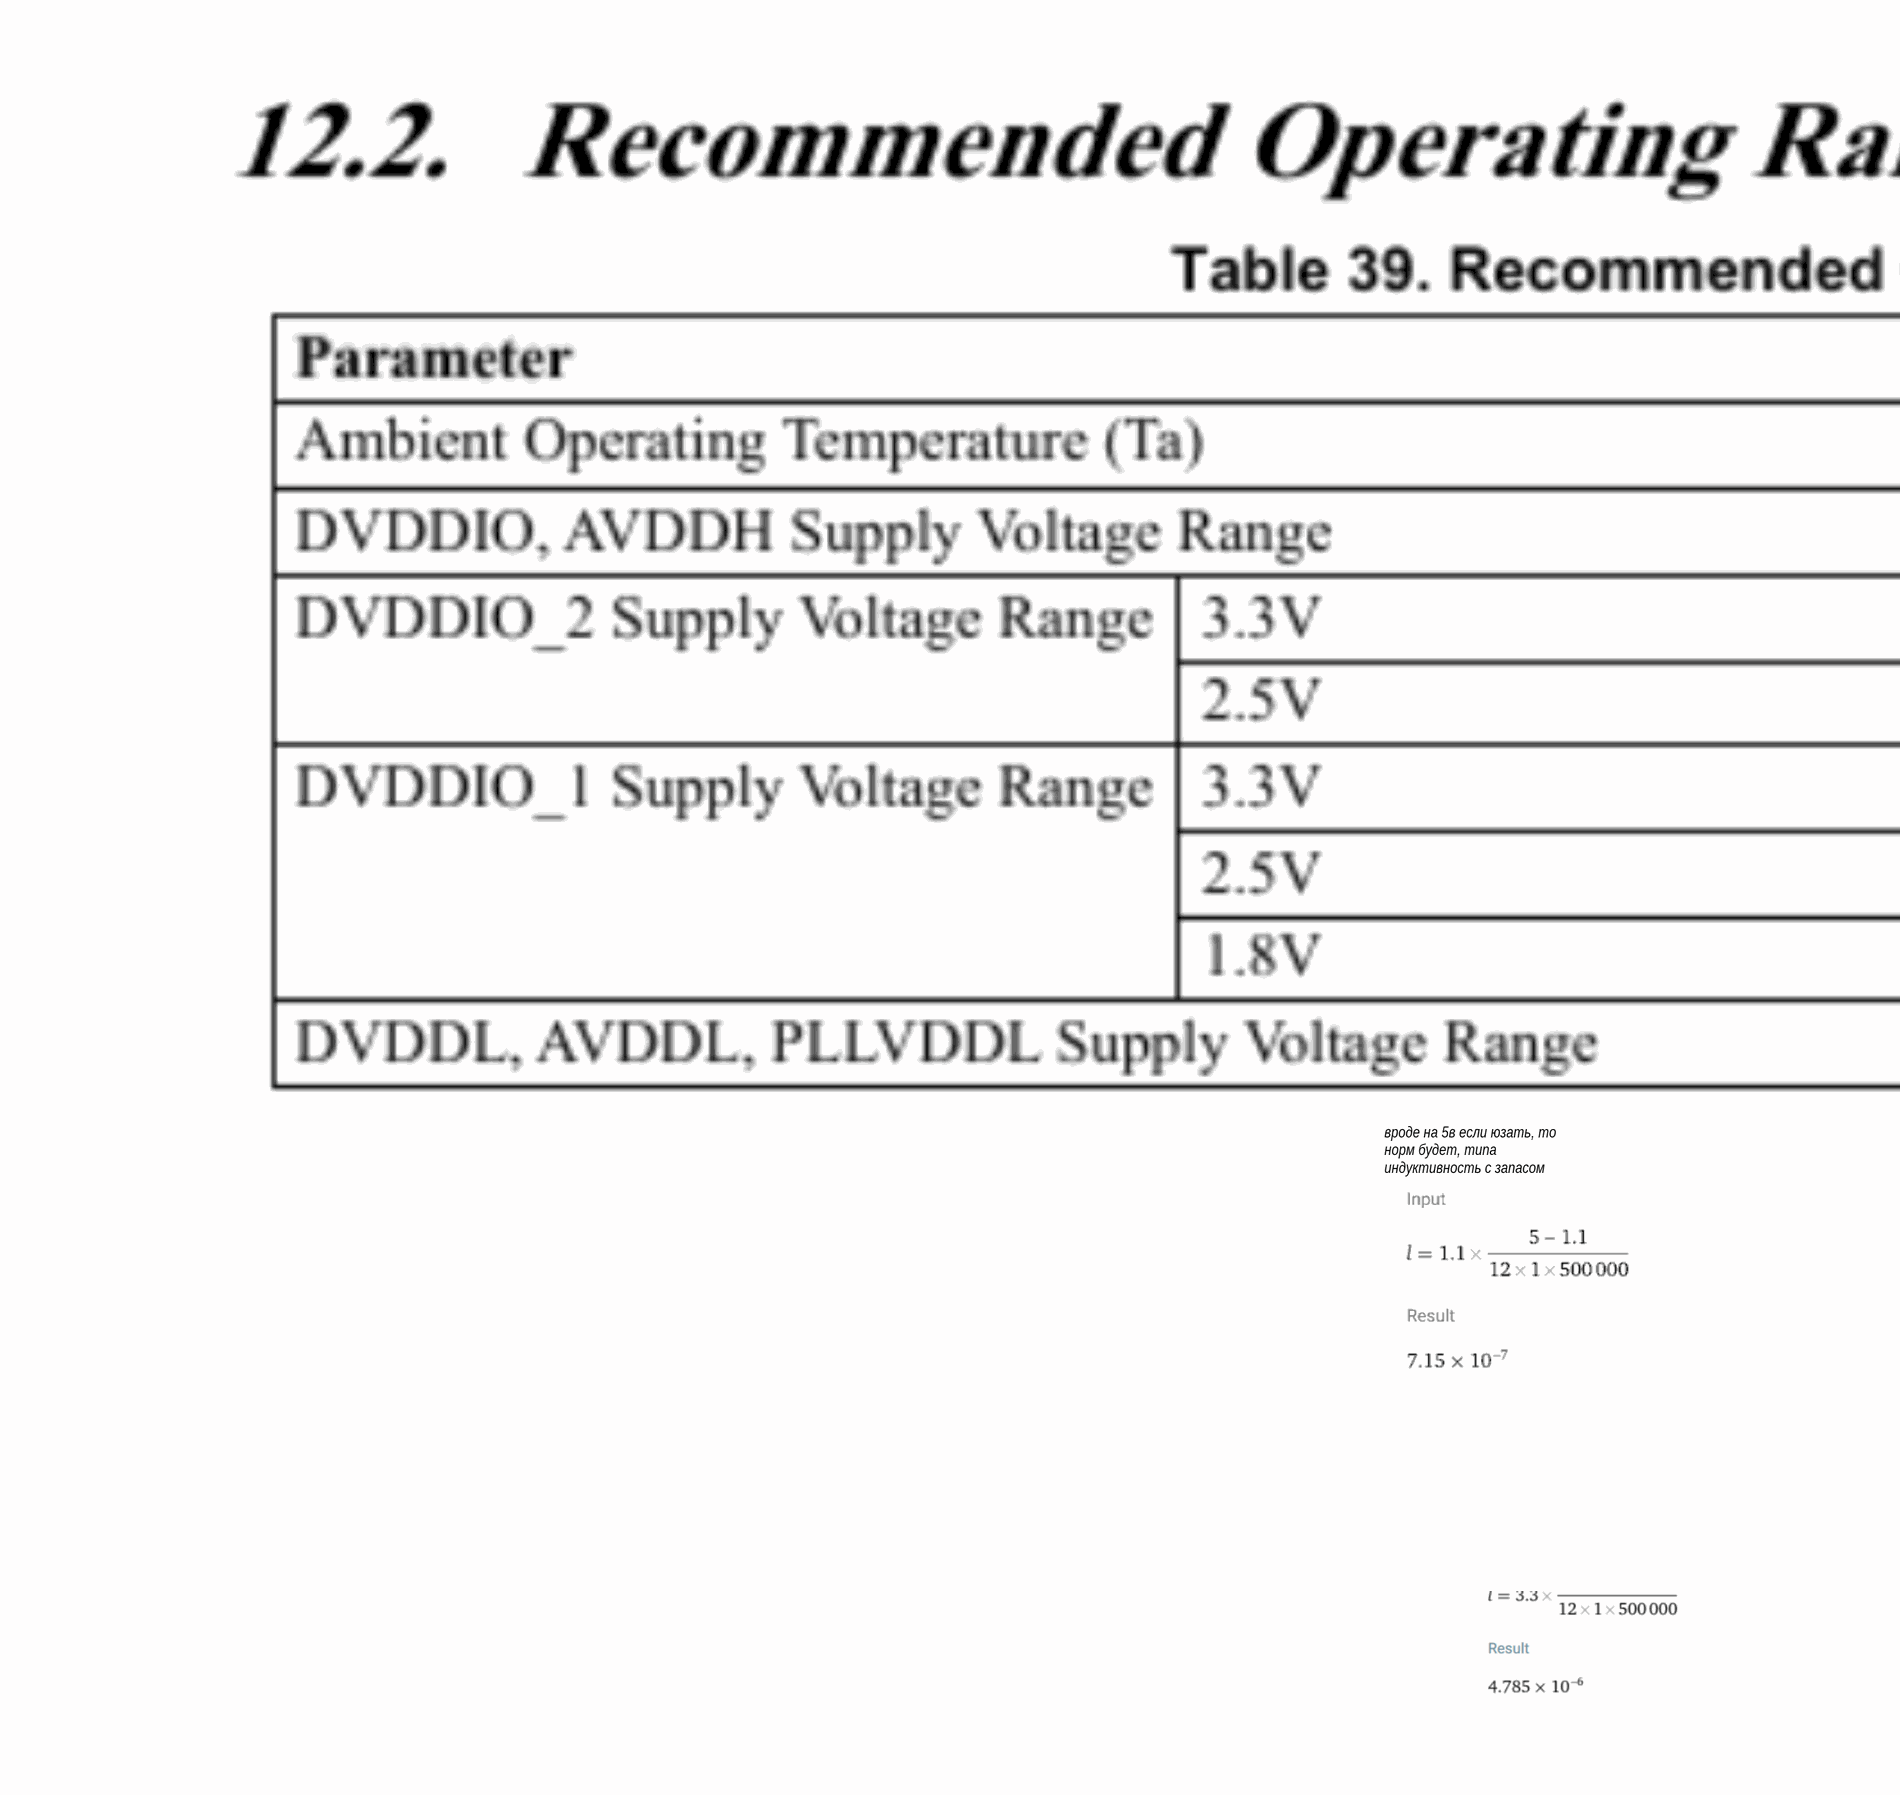
[diagram p6: dc-dc_eth+pump.SchDoc, top left]
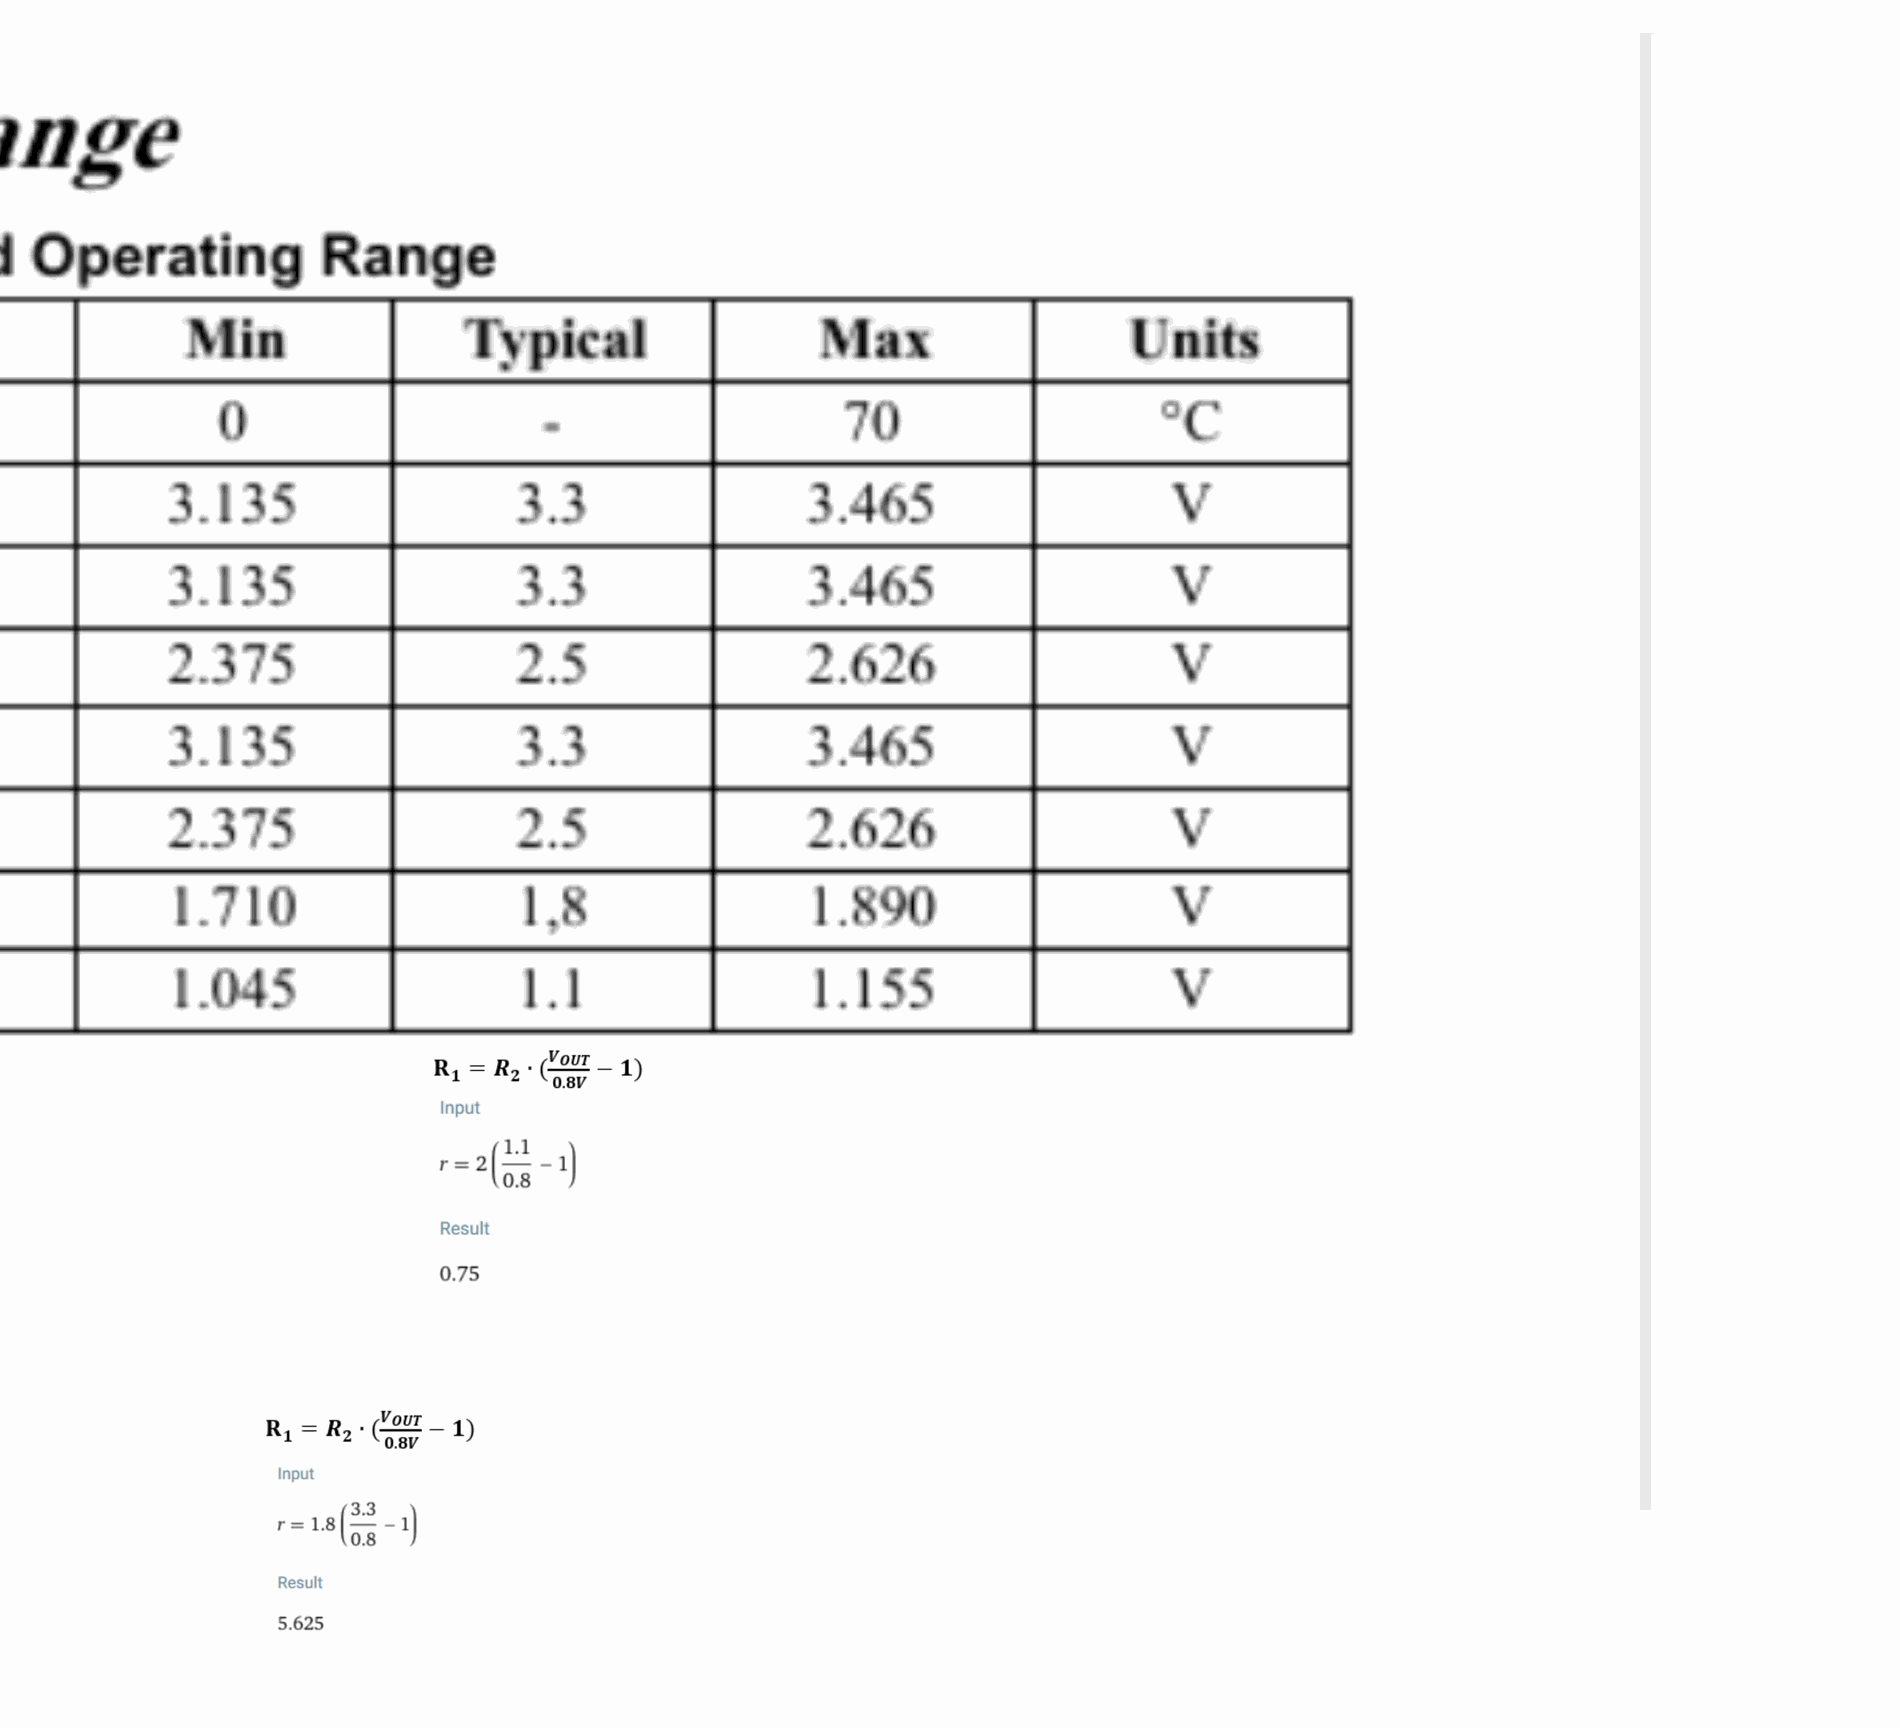
[diagram p7: dc-dc_eth+pump.SchDoc, top right]
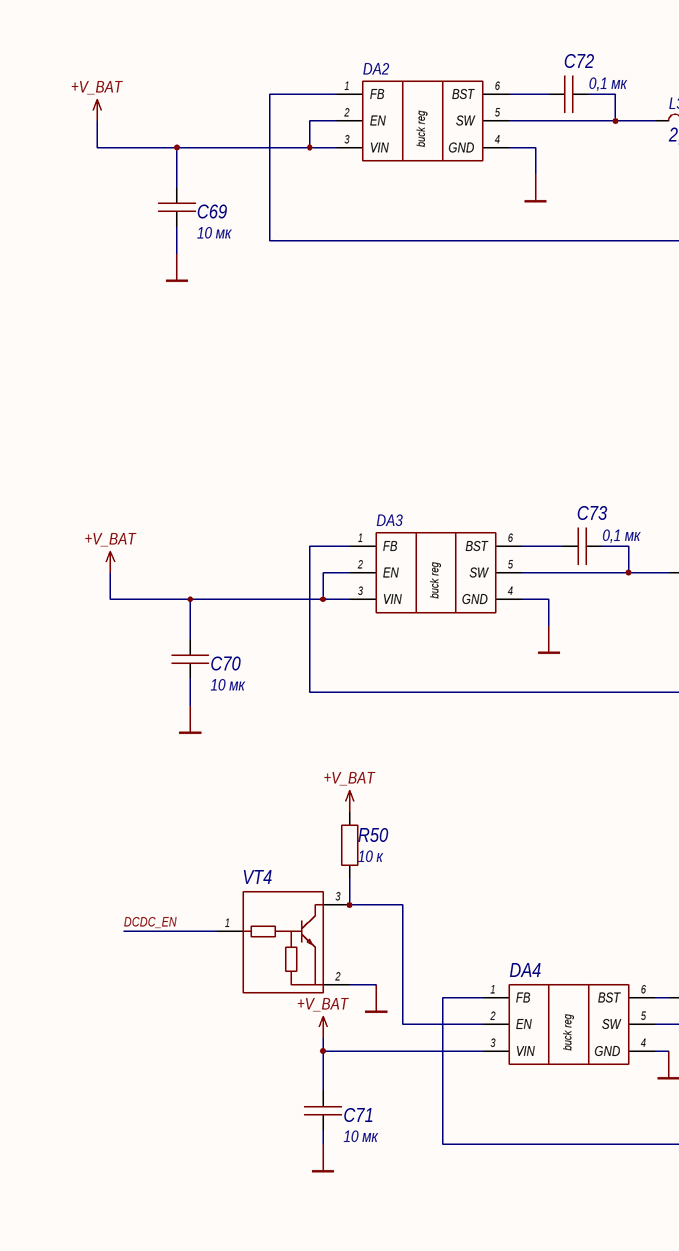
[diagram p8: dc-dc_eth+pump.SchDoc, bottom left]
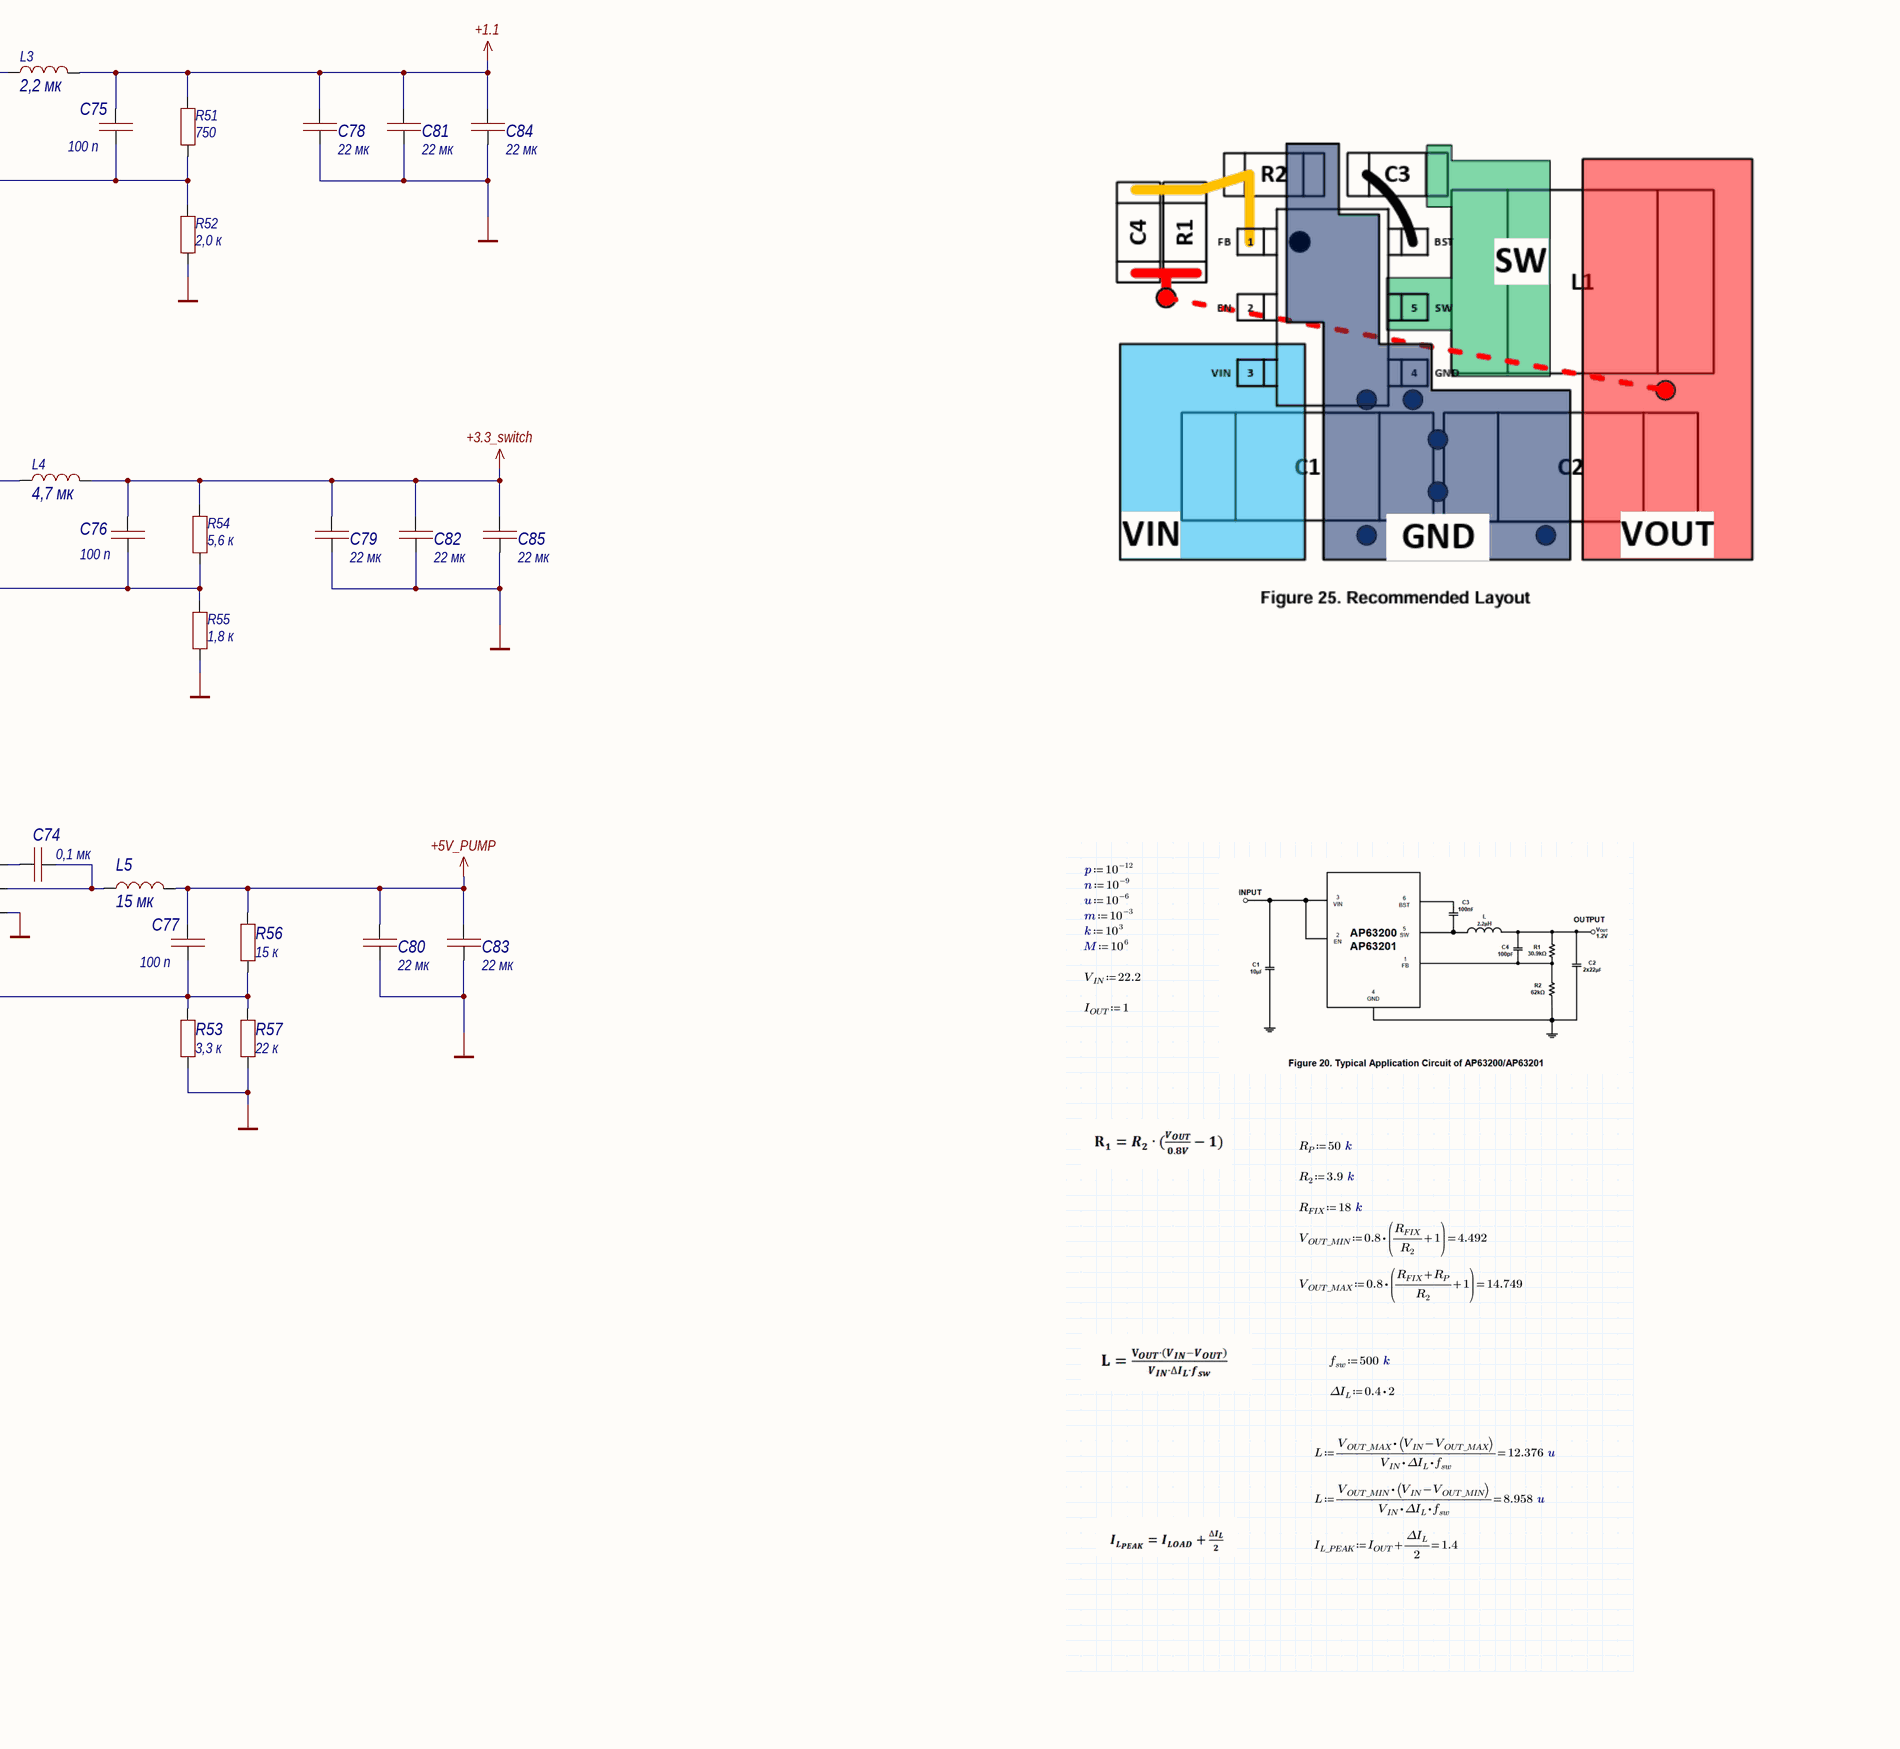
[diagram p9: dc-dc_eth+pump.SchDoc, bottom right]

### Parts
(Parts that share a designator on the sheet are numbered #1, #2 ... from top to bottom, then left to right.)
C69  value 10 мк  [1210C]  (hidden comment: Capacitor)
C70  value 10 мк  [1210C]  (hidden comment: Capacitor)
C71  value 10 мк  [1210C]  (hidden comment: Capacitor)
C72  value 0,1 мк  [0603C]  (hidden comment: Capacitor)
C73  value 0,1 мк  [0603C]  (hidden comment: Capacitor)
C74  value 0,1 мк  [0603C]  (hidden comment: Capacitor)
C75  value 100 п  [0603C]  (hidden comment: Capacitor)
C76  value 100 п  [0603C]  (hidden comment: Capacitor)
C77  value 100 п  [0603C]  (hidden comment: Capacitor)
C78  value 22 мк  [1210C]  (hidden comment: Capacitor)
C79  value 22 мк  [1210C]  (hidden comment: Capacitor)
C80  value 22 мк  [1210C]  (hidden comment: Capacitor)
C81  value 22 мк  [1210C]  (hidden comment: Capacitor)
C82  value 22 мк  [1210C]  (hidden comment: Capacitor)
C83  value 22 мк  [1210C]  (hidden comment: Capacitor)
C84  value 22 мк  [1210C]  (hidden comment: Capacitor)
C85  value 22 мк  [1210C]  (hidden comment: Capacitor)
DA2#2  AP63200  [TSOT26]  (value not drawn)
DA3  AP63200  [TSOT26]  (value not drawn)
DA4  AP63200  [TSOT26]  (value not drawn)
L3  value 2,2 мк  [CDRH6D12]  (hidden comment: CDRH6D12NP-2R2NC)
L4  value 4,7 мк  [B82462G4]  (hidden comment: B82472G6472M)
L5  value 15 мк  [SP43]  (hidden comment: SP43-150K)
R50  value 10 к  [0603R]  (hidden comment: Resistor)
R51  value 750  [0603R]  (hidden comment: Resistor)
R52  value 2,0 к  [0603R]  (hidden comment: Resistor)
R53  value 3,3 к  [0603R]  (hidden comment: Resistor)
R54  value 5,6 к  [0603R]  (hidden comment: Resistor)
R55  value 1,8 к  [0603R]  (hidden comment: Resistor)
R56  value 15 к  [0603R]  (hidden comment: Resistor)
R57  value 22 к  [0603R]  (hidden comment: Resistor)
VT4#2  PDTC114ET  [SOT23-3]  (value not drawn)

### Nets
+1.1: C75.2 C78.2 C81.2 C84.2 L3.3 R51.2
+3.3_switch: C76.2 C79.2 C82.2 C85.2 L4.2 R54.2
+5V_PUMP: C77.2 C80.2 C83.2 L5.2 R56.2
+V_BAT: C69.2 C70.2 C71.2 DA2#2.2(EN) DA2#2.3(VIN) DA3.2(EN) DA3.3(VIN) DA4.3(VIN) R50.2
GND: C69.1 C70.1 C71.1 C78.1 C79.1 C80.1 C81.1 C82.1 C83.1 C84.1 C85.1 DA2#2.4(GND) DA3.4(GND) DA4.4(GND) R52.1 R53.1 R55.1 R57.1 VT4#2.2(E)
DCDC_EN: VT4#2.1(B)
NetC72_1: C72.1 DA2#2.6(BST)
NetC72_2: C72.2 DA2#2.5(SW) L3.1
NetC73_1: C73.1 DA3.6(BST)
NetC73_2: C73.2 DA3.5(SW) L4.1
NetC74_1: C74.1 DA4.6(BST)
NetC74_2: C74.2 DA4.5(SW) L5.1
NetC75_1: C75.1 DA2#2.1(FB) R51.1 R52.2
NetC76_1: C76.1 DA3.1(FB) R54.1 R55.2
NetC77_1: C77.1 DA4.1(FB) R53.2 R56.1 R57.2
NetDA4_2: DA4.2(EN) R50.1 VT4#2.3(C)

### Notes on the sheet
- вроде на 5в если юзать, то норм будет, типа индуктивность с запасом
- Перв. примен.
- Справ. №
- Подп. и дата
- Инв. № дубл.
- Взам. инв. №
- Инв. № подл.
- Изм.
- Лист
- № докум.
- Подп.
- Дата
- Копировал
- Формат А3
- (in symbol AP63200) buck reg

### Library data of the parts
C69-C71 = Capacitor_10u_10_35V_X7R_1210C: as C50 on sheet 1gb_switch; Part Number: Capacitor_10u_10_35V_X7R_1210C; Tolerance: 10%; Dielectric: X7R
C72-C74 = Capacitor_0,1u_10_50V_X7R_0603C: as C5#1 on sheet cm5; Part Number: Capacitor_0,1u_10_50V_X7R_0603C; Tolerance: 10%; Dielectric: X7R
C75-C77 = Capacitor_100p_10_50V_X7R_0603C: Конденсатор 0603C ёмкостью 100 п 10%, 50 В, X7R; Voltage (V): 50; Capacity (nF): 0,1; Part Number: Capacitor_100p_10_50V_X7R_0603C; Tolerance: 10%; Dielectric: X7R
C78-C85 = Capacitor_22u_10_25V_X7R_1210C: as C1#1 on sheet cm5; Part Number: Capacitor_22u_10_25V_X7R_1210C; Tolerance: 10%; Dielectric: X7R
DA2#2 DA3 DA4 = AP63200: DC-DC понижающий преобразователь, Vin: 3.8 - 40 В, adj, 2 А; Part Number: AP63200
L3 = CDRH6D12NP-2R2NC: Индуктивность на 2,2 мкГн, номинальный ток 2,5 А; Inductance (μH): 2,2; Current: 2,5 А; Автор: rreali; Part Number: CDRH6D12NP-2R2NC
L4 = B82472G6472M: Индуктивность на 4,7 мкГн, номинальный ток 2,5 А; Inductance (μH): 4,7; Current: 2,5 А; Автор: rreali; Part Number: B82472G6472M
L5 = SP43-150K: Индуктивность на 15 мкГн, номинальный ток 1,3 А; Inductance (μH): 15; Current: 1,3 А; Part Number: SP43-150K
R50 = Resistor_10k_1_0603: Резистор номиналом 10 кОм 1%; Power: *; Part Number: Resistor_10k_1_0603; Tolerance: 1%
R51 = Resistor_750_1_0603: Резистор номиналом 750 Ом 1%; Power: *; Part Number: Resistor_750_1_0603; Tolerance: 1%
R52 = Resistor_2.0k_1_0603: Резистор номиналом 2,0 кОм 1%; Power: *; Part Number: Resistor_2.0k_1_0603; Tolerance: 1%
R53 = Resistor_3.3k_1_0603: Резистор номиналом 3,3 кОм 1%; Power: *; Part Number: Resistor_3.3k_1_0603; Tolerance: 1%
R54 = Resistor_5.6k_1_0603: Резистор номиналом 5,6 кОм 1%; Power: *; Part Number: Resistor_5.6k_1_0603; Tolerance: 1%
R55 = Resistor_1.8k_1_0603: Резистор номиналом 1,8 кОм 1%; Power: *; Part Number: Resistor_1.8k_1_0603; Tolerance: 1%
R56 = Resistor_15k_1_0603: Резистор номиналом 15 кОм 1%; Power: *; Part Number: Resistor_15k_1_0603; Tolerance: 1%
R57 = Resistor_22k_1_0603: Резистор номиналом 22 кОм 1%; Power: *; Part Number: Resistor_22k_1_0603; Tolerance: 1%
VT4#2 = PDTC114ET: цифровой npn 50в 100мА; Current (A): 0, 1 А; Part Number: PDTC114ET; Voltage (V): 50 В

## Sheet connectors.SchDoc: Материнская плата аппарата NeoWelt v.2
size 594 x 420 mm; PageSetup: Record=PageOptions|CenterHorizontal=True|CenterVertical=True|PrintScale=0.94|XCorrection=1.00|YCorrection=1.00|PrintKind=1|BorderSize=5000000|LeftOffset=0|BottomOffset=0|Orientation=1|PaperLength=1000|PaperWidth=1000|Scale=100|PaperSource=7|PrintQuality=-4|MediaType=1|DitherType=10|PaperKind=A4|PrintScaleMode=1; Address1: Address1; Address2: Address2; Address3: Address3; Address4: Address4; DocumentNumber: 5; SheetNumber: 3; SheetTotal: 4
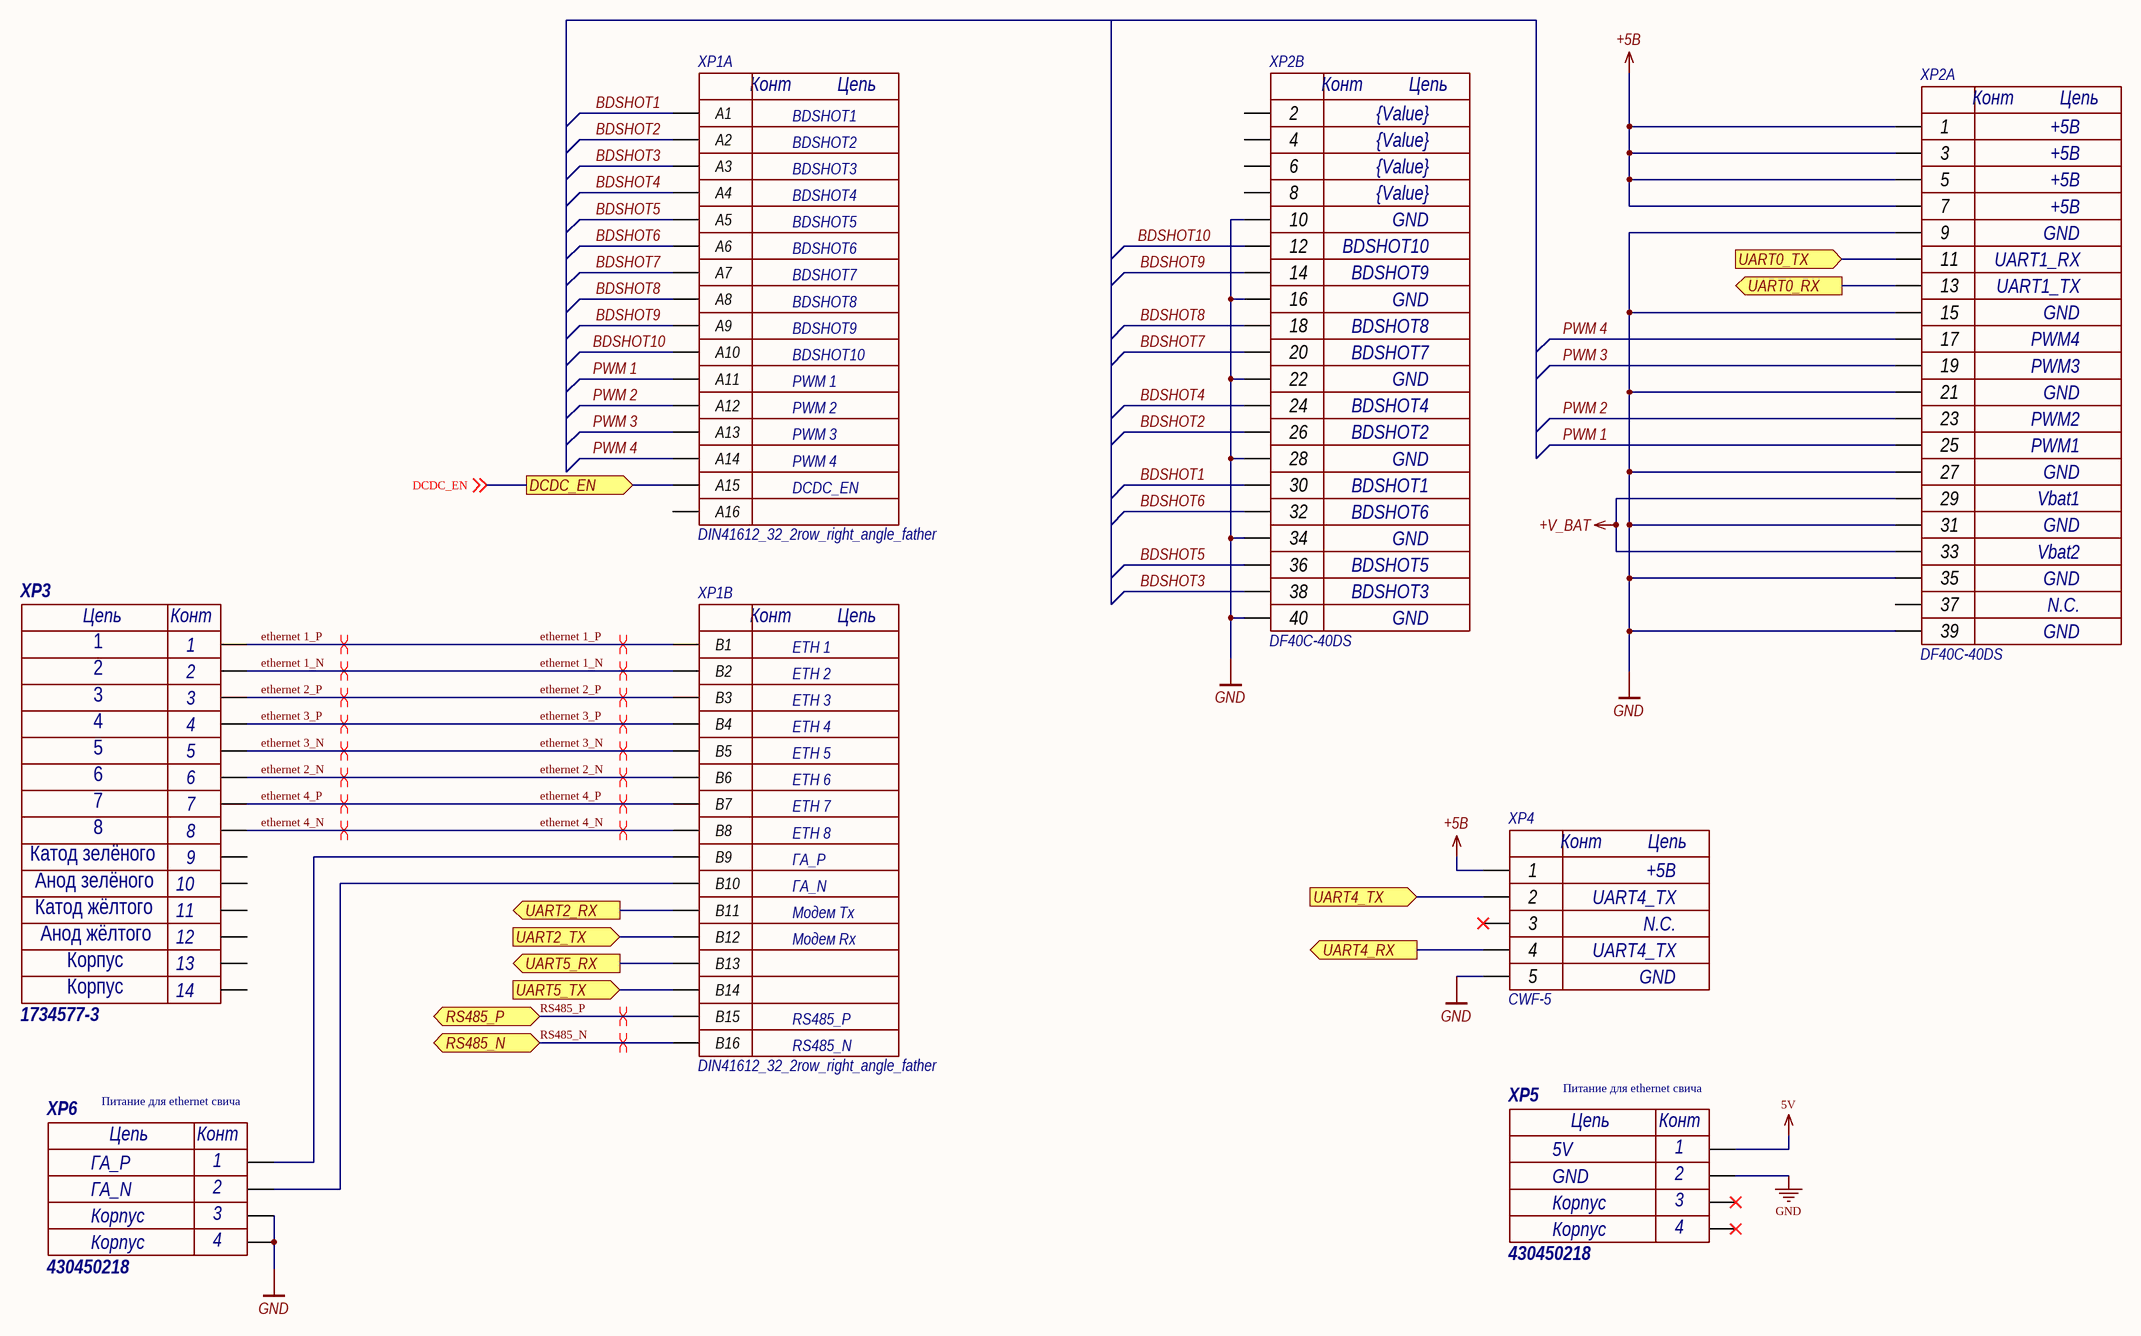
[diagram p10: connectors.SchDoc]

### Parts
XP1  DIN41612_32_2row_right_angle_father  [DIN41612_32_2row_right_angle_father]  (parts A,B of 2)
XP2  DF40C-40DS  Value17: Vbat2  Value20: GND  Value19: N.C.  Value15: Vbat1  Value13: PWM1  Value12: PWM2  Value10: PWM3  Value9: PWM4  Value7: UART1_TX  Value6: UART1_RX  Value4: +5В  [DF40C-40DS]  (parts A,B of 2)
XP3  1734577-3  [1-1734577-3-rj45-8p8c]
XP4  CWF-5  Value1: +5В  Value2: UART4_TX  Value3: N.C.  Value5: GND  [CWF-5]
XP5  430450218  Value3: Корпус  Value2: GND  Value1: 5V  Parameter 1: Питание для ethernet свича  [Molex_430450218]
XP6  430450218  Value3: Корпус  Value2: ГА_N  Value1: ГА_P  Parameter 1: Питание для ethernet свича  [Molex_430450218]

### Ports
DCDC_EN (out), RS485_N (bidir), RS485_P (bidir), UART0_RX (out), UART0_TX (in), UART2_RX (out), UART2_TX (in), UART4_RX (out), UART4_TX (in), UART5_RX (out), UART5_TX (in)

### Nets
5V: XP5.1
+5В: XP2.1 XP2.3 XP2.5 XP2.7 XP4.1
+V_BAT: XP2.29 XP2.33
GND: XP2.9 XP2.10 XP2.15 XP2.16 XP2.21 XP2.22 XP2.27 XP2.28 XP2.31 XP2.34 XP2.35 XP2.39 XP2.40 XP4.5 XP5.2 XP6.0
BDSHOT1: XP1.A1 XP2.30
BDSHOT2: XP1.A2 XP2.26
BDSHOT3: XP1.A3 XP2.38
BDSHOT4: XP1.A4 XP2.24
BDSHOT5: XP1.A5 XP2.36
BDSHOT6: XP1.A6 XP2.32
BDSHOT7: XP1.A7 XP2.20
BDSHOT8: XP1.A8 XP2.18
BDSHOT9: XP1.A9 XP2.14
BDSHOT10: XP1.A10 XP2.12
DCDC_EN: XP1.A15 ; off-sheet DCDC_EN, port DCDC_EN
ethernet 1_N: XP1.B2 XP3.2
ethernet 1_P: XP1.B1 XP3.1
ethernet 2_N: XP1.B6 XP3.6
ethernet 2_P: XP1.B3 XP3.3
ethernet 3_N: XP1.B5 XP3.5
ethernet 3_P: XP1.B4 XP3.4
ethernet 4_N: XP1.B8 XP3.8
ethernet 4_P: XP1.B7 XP3.7
PWM 1: XP1.A11 XP2.25
PWM 2: XP1.A12 XP2.23
PWM 3: XP1.A13 XP2.19
PWM 4: XP1.A14 XP2.17
RS485_N: XP1.B16 ; port RS485_N
RS485_P: XP1.B15 ; port RS485_P
NetXP1_B9: XP1.B9 XP6.1
NetXP1_B10: XP1.B10 XP6.2
NetXP1_B11: XP1.B11 ; port UART2_RX
NetXP1_B12: XP1.B12 ; port UART2_TX
NetXP1_B13: XP1.B13 ; port UART5_RX
NetXP1_B14: XP1.B14 ; port UART5_TX
NetXP2_11: XP2.11 ; port UART0_TX
NetXP2_13: XP2.13 ; port UART0_RX
NetXP4_2: XP4.2 ; port UART4_TX
NetXP4_4: XP4.4 ; port UART4_RX

Not connected (* = marked no-connect by the designer): XP1 A16; XP2 2 4 6 8 37; XP3 9 10 11 12 MH1 MH2; XP4 3*; XP5 0*

### Layout directives
differential pair: ethernet 1_N, ethernet 1_P, ethernet 2_N, ethernet 2_P, ethernet 3_N, ethernet 3_P, ethernet 4_N, ethernet 4_P, RS485_N, RS485_P

### Notes on the sheet
- BDSHOT1
- BDSHOT2
- BDSHOT3
- BDSHOT4
- BDSHOT5
- BDSHOT6
- BDSHOT7
- BDSHOT8
- BDSHOT9
- BDSHOT10
- PWM 1
- PWM 2
- PWM 3
- PWM 4
- DCDC_EN
- ETH 1
- ETH 2
- ETH 3
- ETH 4
- ETH 5
- ETH 6
- ETH 7
- ETH 8
- ГА_P
- ГА_N
- Модем Tx
- Модем Rx
- RS485_P
- RS485_N
- Перв. примен.
- Справ. №
- Подп. и дата
- Инв. № дубл.
- Взам. инв. №
- Инв. № подл.
- Изм.
- Лист
- № докум.
- Подп.
- Дата
- Копировал
- Формат А2
- (in symbol 1-1734577-3-rj45-8p8c) Цепь; Конт; Катод зелёного; Анод зелёного; Катод жёлтого; Анод жёлтого; Корпус; 13; 14
- (in symbol CWF-5) Конт; Цепь
- (in symbol DIN41612_32_2row_right_angle_father, part A) Конт; Цепь
- (in symbol DIN41612_32_2row_right_angle_father, part B) Конт; Цепь

### Library data of the parts
XP1 = DIN41612_32_2row_right_angle_father: DIN41612R (DS1118-32M0R23), Разъем (вилка) тип B 32pin (2х16), шаг 2.54мм двухрядный угловой (ряд АВ); Part Number: DIN41612_32_2row_right_angle_father
XP2 = DF40C-40DS: Разъем плата-плата 40 пинов, папа, шаг 0.4мм; System: Connector; Value18: GND; Value16: GND; Value14: GND; Value11: GND; Value8: GND; Value5: GND; Value3: +5В; Value2: +5В; Value1: +5В; Part Number: DF40C-40DS
XP3 = 1-1734577-3-rj45-8p8c: Модульный разъем, Cat3, RJ45, Гнездо, 8 контакт(-ов), 8 вывод(-ов), 1 порт(-ов); Part Number: 1-1734577-3-rj45-8p8c
XP4 = CWF-5: 5-пиновый разъем с ключом; System: Connector; Value4: UART4_TX; Part Number: CWF-5
XP5 XP6 = Molex_430450218: Разъем типа провод-плата, 3 мм, 2 контакт(-ов), Штыревой Разъем, Серия Micro-Fit для поверхностного монтажа; Value4: Корпус; Part Number: Molex_430450218